# EAGLE schematic Nava_v1.02 (EAGLE 6.1), part 2 of 2
## Sheet 6 of 15: HT
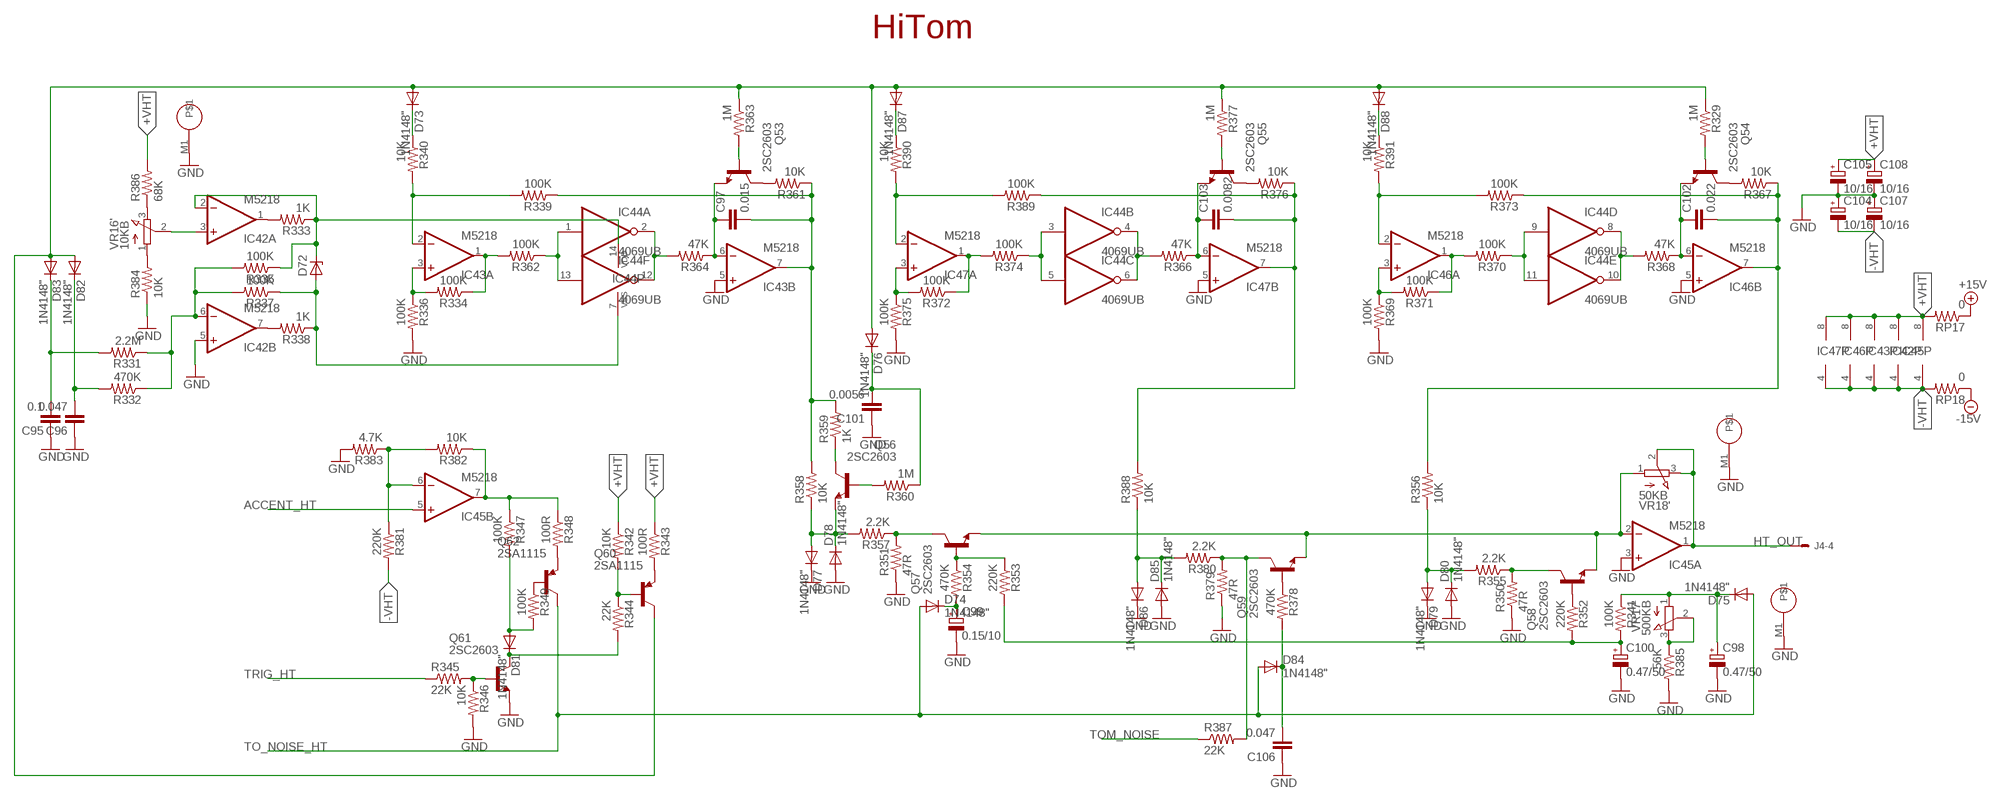
[diagram p5: schematic, sheet 6]

### Parts
C95  0.1  C-EU050-025X075  [C050-025X075]
C96  0.047  C-EU050-025X075  [C050-025X075]
C97  0.015  C-EU050-025X075  [C050-025X075]
C98  0.47/50  CPOL-EUE2-5  [E2-5]
C99  0.15/10  CPOL-EUE2-5  [E2-5]
C100  0.47/50  CPOL-EUE2-5  [E2-5]
C101  0.0056  C-EU050-025X075  [C050-025X075]
C102  0.022  C-EU050-025X075  [C050-025X075]
C103  0.0082  C-EU050-025X075  [C050-025X075]
C104  10/16  CPOL-EUE2-5  [E2-5]
C105  10/16  CPOL-EUE2-5  [E2-5]
C106  0.047  C-EU050-025X075  [C050-025X075]
C107  10/16  CPOL-EUE2-5  [E2-5]
C108  10/16  CPOL-EUE2-5  [E2-5]
D72  ZENER-DIODE  [DO41-7]
D73  1N4148"  [DO35-7C]
D74  1N4148"  [DO35-7C]
D75  1N4148"  [DO35-7C]
D76  1N4148"  [DO35-7C]
D77  1N4148"  [DO35-7C]
D78  1N4148"  [DO35-7C]
D79  1N4148"  [DO35-7C]
D80  1N4148"  [DO35-7C]
D81  1N4148"  [DO35-7C]
D82  1N4148"  [DO35-7C]
D83  1N4148"  [DO35-7C]
D84  1N4148"  [DO35-7C]
D85  1N4148"  [DO35-7C]
D86  1N4148"  [DO35-7C]
D87  1N4148"  [DO35-7C]
D88  1N4148"  [DO35-7C]
IC42  M5218  [SIL8]
IC43  M5218  [SIL8]
IC44  4069UB  4069N  [DIL14]
IC45  M5218  [SIL8]
IC46  M5218  [SIL8]
IC47  M5218  [SIL8]
Q53  2SC2603  [TO92-ECB]
Q54  2SC2603  [TO92-ECB]
Q55  2SC2603  [TO92-ECB]
Q56  2SC2603  [TO92-ECB]
Q57  2SC2603  [TO92-ECB]
Q58  2SC2603  [TO92-ECB]
Q59  2SC2603  [TO92-ECB]
Q60  2SA1115  [TO92-ECB-PNP]
Q61  2SC2603  [TO92-ECB]
Q62  2SA1115  [TO92-ECB-PNP]
R329  1M  R-US_0207/7  [0207/7]
R331  2.2M  R-US_0207/7  [0207/7]
R332  470K  R-US_0207/7  [0207/7]
R333  1K  R-US_0207/7  [0207/7]
R334  100K  R-US_0207/7  [0207/7]
R335  100K  R-US_0207/7  [0207/7]
R336  100K  R-US_0207/7  [0207/7]
R337  100K  R-US_0207/7  [0207/7]
R338  1K  R-US_0207/7  [0207/7]
R339  100K  R-US_0207/7  [0207/7]
R340  10K  R-US_0207/7  [0207/7]
R341  100K  R-US_0207/7  [0207/7]
R342  10K  R-US_0207/7  [0207/7]
R343  100R  R-US_0207/7  [0207/7]
R344  22K  R-US_0207/7  [0207/7]
R345  22K  R-US_0207/7  [0207/7]
R346  10K  R-US_0207/7  [0207/7]
R347  100K  R-US_0207/7  [0207/7]
R348  100R  R-US_0207/7  [0207/7]
R349  100K  R-US_0207/7  [0207/7]
R350  47R  R-US_0207/7  [0207/7]
R351  47R  R-US_0207/7  [0207/7]
R352  220K  R-US_0207/7  [0207/7]
R353  220K  R-US_0207/7  [0207/7]
R354  470K  R-US_0207/7  [0207/7]
R355  2.2K  R-US_0207/7  [0207/7]
R356  10K  R-US_0207/7  [0207/7]
R357  2.2K  R-US_0207/7  [0207/7]
R358  10K  R-US_0207/7  [0207/7]
R359  1K  R-US_0207/7  [0207/7]
R360  1M  R-US_0207/7  [0207/7]
R361  10K  R-US_0207/7  [0207/7]
R362  100K  R-US_0207/7  [0207/7]
R363  1M  R-US_0207/7  [0207/7]
R364  47K  R-US_0207/7  [0207/7]
R366  47K  R-US_0207/7  [0207/7]
R367  10K  R-US_0207/7  [0207/7]
R368  47K  R-US_0207/7  [0207/7]
R369  100K  R-US_0207/7  [0207/7]
R370  100K  R-US_0207/7  [0207/7]
R371  100K  R-US_0207/7  [0207/7]
R372  100K  R-US_0207/7  [0207/7]
R373  100K  R-US_0207/7  [0207/7]
R374  100K  R-US_0207/7  [0207/7]
R375  100K  R-US_0207/7  [0207/7]
R376  10K  R-US_0207/7  [0207/7]
R377  1M  R-US_0207/7  [0207/7]
R378  470K  R-US_0207/7  [0207/7]
R379  47R  R-US_0207/7  [0207/7]
R380  2.2K  R-US_0207/7  [0207/7]
R381  220K  R-US_0207/7  [0207/7]
R382  10K  R-US_0207/7  [0207/7]
R383  4.7K  R-US_0207/7  [0207/7]
R384  10K  R-US_0207/7  [0207/7]
R385  56K  R-US_0207/7  [0207/7]
R386  68K  R-US_0207/7  [0207/7]
R387  22K  R-US_0207/7  [0207/7]
R388  10K  R-US_0207/7  [0207/7]
R389  100K  R-US_0207/7  [0207/7]
R390  10K  R-US_0207/7  [0207/7]
R391  10K  R-US_0207/7  [0207/7]
RP17  0  R-US_0207/7  [0207/7]
RP18  0  R-US_0207/7  [0207/7]
VR16  10KB  EVUF3A  [EVUF]
VR17  500KB  EVUF3A  [EVUF]
VR18  50KB  EVUF3A  [EVUF]

### Nets
+15V: RP17.1 ; also sheet 1,2,3,4,7,8,9,11,12,13
+VHT: C105.+ C108.+ IC42.8(P:V+) IC43.8(P:V+) IC45.8(P:V+) IC46.8(P:V+) IC47.8(P:V+) R342.1 R343.1 R386.2 RP17.2
-15V: RP18.1 ; also sheet 1,2,3,4,7,8,9,11,12,13
-VHT [power]: C104.- C107.- IC42.4(P:V-) IC43.4(P:V-) IC45.4(P:V-) IC46.4(P:V-) IC47.4(P:V-) R381.2 RP18.2
ACCENT_HT: IC45.5(B:+IN) ; also sheet 1
GND: C95.1 C96.1 C98.- C99.- C100.- C101.1 C104.+ C105.- C106.1 C107.+ C108.- D77.C D78.A D79.C D80.A D85.A D86.C IC42.5(B:+IN) IC43.5(B:+IN) IC45.3(A:+IN) IC46.5(B:+IN) IC47.5(B:+IN) Q61.E R336.2 R346.2 R350.1 R351.1 R369.2 R375.2 R379.1 R383.2 R384.1 R385.2 VR16.M1 VR17.M1 VR18.M1 ; also sheet 1,2,3,4,5,7,8,9,10,11,12,13,14,15
HT_OUT: IC45.1(A:OUT) J4.4 VR18.2(':S) VR18.3(':E)
N$618: C97.1 IC43.6(B:-IN) Q53.E R364.1
N$619: Q53.C R361.2
N$620: IC42.1(A:OUT) R333.2
N$621: IC42.7(B:OUT) R338.2
N$622: IC42.6(B:-IN) R331.1 R332.1 R335.2 R337.2
N$623: D72.A IC44.7(P:VSS) R337.1 R338.1
N$624: D72.C IC42.2(A:-IN) IC44.14(P:VDD) R333.1 R335.1
N$625: R386.1 VR16.3(':E)
N$626: R384.2 VR16.1(':A)
N$627: IC42.3(A:+IN) VR16.2(':S)
N$628: IC43.3(A:+IN) R334.2 R336.1
N$629: IC43.2(A:-IN) R339.2 R340.2
N$630: IC43.1(A:OUT) R334.1 R362.2
N$631: IC44.1(A:I) IC44.13(F:I) R362.1
N$632: IC44.2(A:O) IC44.12(F:O) R364.2
N$644: Q53.B R363.2
N$683: C97.2 IC43.7(B:OUT) R339.1 R358.2 R359.2 R361.1
N$684: D73.C R340.1
N$685: C103.1 IC47.6(B:-IN) Q55.E R366.1
N$686: Q55.C R376.2
N$687: IC47.3(A:+IN) R372.2 R375.1
N$688: IC47.2(A:-IN) R389.2 R390.2
N$689: IC47.1(A:OUT) R372.1 R374.2
N$690: IC44.3(B:I) IC44.5(C:I) R374.1
N$691: IC44.4(B:O) IC44.6(C:O) R366.2
N$692: Q55.B R377.2
N$693: C103.2 IC47.7(B:OUT) R376.1 R388.2 R389.1
N$694: D87.C R390.1
N$695: C102.1 IC46.6(B:-IN) Q54.E R368.1
N$696: Q54.C R367.2
N$697: IC46.3(A:+IN) R369.1 R371.2
N$698: IC46.2(A:-IN) R373.2 R391.2
N$699: IC46.1(A:OUT) R370.2 R371.1
N$700: IC44.9(D:I) IC44.11(E:I) R370.1
N$701: IC44.8(D:O) IC44.10(E:O) R368.2
N$702: Q54.B R329.2
N$703: C102.2 IC46.7(B:OUT) R356.2 R367.1 R373.1
N$704: D88.C R391.1
N$705: C96.2 D82.C R332.2
N$706: C95.2 D83.C R331.2
N$718: D73.A D76.A D82.A D83.A D87.A D88.A Q60.C R329.1 R363.1 R377.1
N$740: Q57.B R353.1 R354.1
N$744: Q57.C R351.2 R357.1
N$745: D77.A D78.C Q56.E R357.2 R358.1
N$746: Q59.B R378.1
N$747: Q59.C R379.2 R380.1 R387.2
N$748: D85.C D86.A R380.2 R388.1
N$749: Q58.B R352.1
N$750: Q58.C R350.2 R355.1
N$751: D79.A D80.C R355.2 R356.1
N$752: Q56.C R359.1
N$753: C101.2 D76.C R360.1
N$754: Q56.B R360.2
N$755: IC45.2(A:-IN) Q57.E Q58.E Q59.E VR18.1(':A)
N$756: C98.+ D75.C R341.1 VR17.1(':A)
N$757: R385.1 VR17.2(':S) VR17.3(':E)
N$758: C100.+ R341.2 R352.2 R353.2
N$759: C106.2 D84.C R378.2
N$760: C99.+ D74.C R354.2
N$761: Q62.E R348.2
N$762: Q62.B R349.1
N$763: D81.C Q61.C R344.2
N$764: IC45.6(B:-IN) R381.1 R382.2 R383.1
N$765: IC45.7(B:OUT) R347.1 R348.1 R382.1
N$766: D81.A R347.2 R349.2
N$767: Q61.B R345.2 R346.1
N$768: Q60.E R343.2
N$769: Q60.B R342.2 R344.1
TO_NOISE_HT: D74.A D75.A D84.A Q62.C ; also sheet 12
TOM_NOISE: R387.1 ; also sheet 4,5,12
TRIG_HT: R345.1 ; also sheet 1,12
Unconnected: VR16.M2 VR17.M2 VR18.M2

### Notes on the sheet
- HiTom

## Sheet 7 of 15: RM
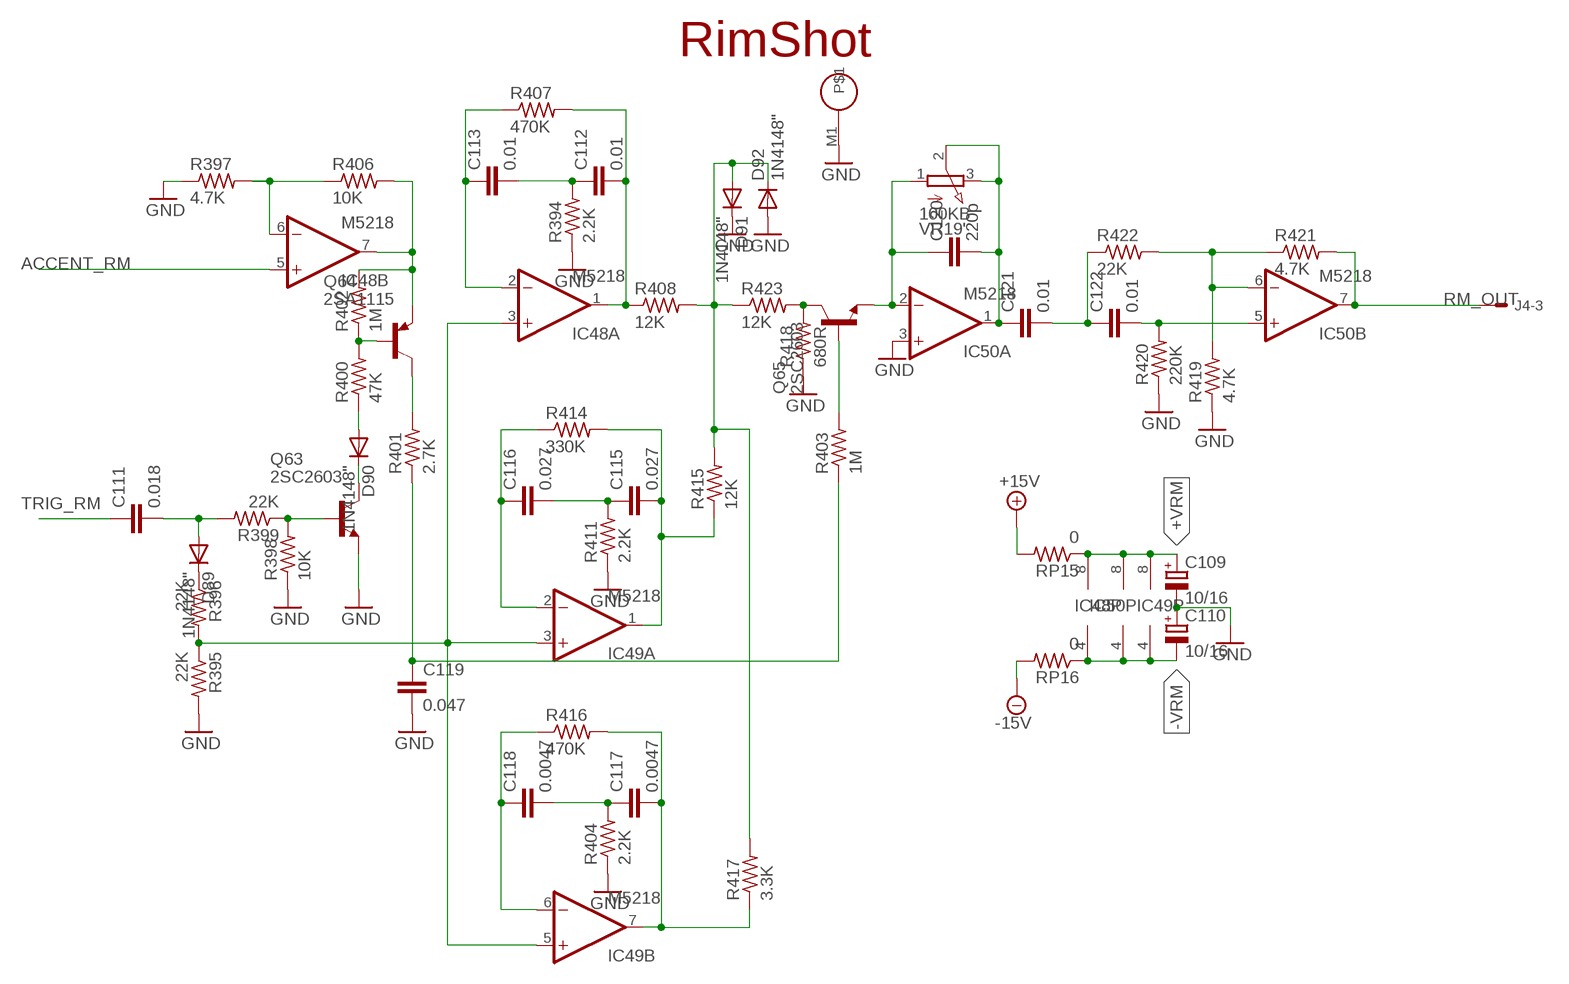
[diagram p6: schematic, sheet 7]

### Parts
C109  10/16  CPOL-EUE2-5  [E2-5]
C110  10/16  CPOL-EUE2-5  [E2-5]
C111  0.018  C-EU050-025X075  [C050-025X075]
C112  0.01  C-EU050-025X075  [C050-025X075]
C113  0.01  C-EU050-025X075  [C050-025X075]
C115  0.027  C-EU050-025X075  [C050-025X075]
C116  0.027  C-EU050-025X075  [C050-025X075]
C117  0.0047  C-EU050-025X075  [C050-025X075]
C118  0.0047  C-EU050-025X075  [C050-025X075]
C119  0.047  C-EU050-025X075  [C050-025X075]
C120  220p  C-EU050-025X075  [C050-025X075]
C121  0.01  C-EU050-025X075  [C050-025X075]
C122  0.01  C-EU050-025X075  [C050-025X075]
D89  1N4148"  [DO35-7C]
D90  1N4148"  [DO35-7C]
D91  1N4148"  [DO35-7C]
D92  1N4148"  [DO35-7C]
IC48  M5218  [SIL8]
IC49  M5218  [SIL8]
IC50  M5218  [SIL8]
Q63  2SC2603  [TO92-ECB]
Q64  2SA1115  [TO92-ECB-PNP]
Q65  2SC2603  [TO92-ECB]
R394  2.2K  R-US_0207/7  [0207/7]
R395  22K  R-US_0207/7  [0207/7]
R396  22K  R-US_0207/7  [0207/7]
R397  4.7K  R-US_0207/7  [0207/7]
R398  10K  R-US_0207/7  [0207/7]
R399  22K  R-US_0207/7  [0207/7]
R400  47K  R-US_0207/7  [0207/7]
R401  2.7K  R-US_0207/7  [0207/7]
R402  1M  R-US_0207/7  [0207/7]
R403  1M  R-US_0207/7  [0207/7]
R404  2.2K  R-US_0207/7  [0207/7]
R406  10K  R-US_0207/7  [0207/7]
R407  470K  R-US_0207/7  [0207/7]
R408  12K  R-US_0207/7  [0207/7]
R411  2.2K  R-US_0207/7  [0207/7]
R414  330K  R-US_0207/7  [0207/7]
R415  12K  R-US_0207/7  [0207/7]
R416  470K  R-US_0207/7  [0207/7]
R417  3.3K  R-US_0207/7  [0207/7]
R418  680R  R-US_0207/7  [0207/7]
R419  4.7K  R-US_0207/7  [0207/7]
R420  220K  R-US_0207/7  [0207/7]
R421  4.7K  R-US_0207/7  [0207/7]
R422  22K  R-US_0207/7  [0207/7]
R423  12K  R-US_0207/7  [0207/7]
RP15  0  R-US_0207/7  [0207/7]
RP16  0  R-US_0207/7  [0207/7]
VR19  100KB  EVUF3A  [EVUF]

### Nets
+15V: RP15.2 ; also sheet 1,2,3,4,6,8,9,11,12,13
+VRM: C109.+ IC48.8(P:V+) IC49.8(P:V+) IC50.8(P:V+) RP15.1
-15V: RP16.2 ; also sheet 1,2,3,4,6,8,9,11,12,13
-VRM: C110.- IC48.4(P:V-) IC49.4(P:V-) IC50.4(P:V-) RP16.1
ACCENT_RM: IC48.5(B:+IN) ; also sheet 1
C117: C117.2 IC49.7(B:OUT) R416.2 R417.1
GND: C109.- C110.+ C119.2 D91.C D92.A IC50.3(A:+IN) Q63.E R394.1 R395.2 R397.1 R398.1 R404.1 R411.1 R418.1 R419.1 R420.1 VR19.M1 ; also sheet 1,2,3,4,5,6,8,9,10,11,12,13,14,15
N$275: C115.1 C116.2 R411.2
N$281: C116.1 IC49.2(A:-IN) R414.1
N$282: C115.2 IC49.1(A:OUT) R414.2 R415.1
N$283: C112.1 C113.2 R394.2
N$284: C113.1 IC48.2(A:-IN) R407.1
N$285: C112.2 IC48.1(A:OUT) R407.2 R408.1
N$286: C117.1 C118.2 R404.2
N$287: C118.1 IC49.6(B:-IN) R416.1
N$288: Q64.B R400.2 R402.1
N$289: Q63.B R398.2 R399.1
N$290: D89.C R396.1
N$291: IC48.3(A:+IN) IC49.3(A:+IN) IC49.5(B:+IN) R395.1 R396.2
N$292: C111.2 D89.A R399.2
N$293: D90.C Q63.C
N$294: D90.A R400.1
N$295: Q64.C R401.2
N$296: C119.1 R401.1 R403.1
N$297: IC48.7(B:OUT) Q64.E R402.2 R406.2
N$298: IC48.6(B:-IN) R397.2 R406.1
N$299: Q65.C R418.2 R423.2
N$300: D91.A D92.C R408.2 R415.2 R417.2 R423.1
N$384: Q65.B R403.2
N$450: C120.1 IC50.2(A:-IN) Q65.E VR19.1(':A)
N$469: C120.2 C121.1 IC50.1(A:OUT) VR19.2(':S) VR19.3(':E)
N$485: C121.2 C122.1 R422.1
N$616: IC50.6(B:-IN) R419.2 R421.1 R422.2
N$617: C122.2 IC50.5(B:+IN) R420.2
RM_OUT: IC50.7(B:OUT) J4.3 R421.2
TRIG_RM: C111.1 ; also sheet 1
Unconnected: VR19.M2

### Notes on the sheet
- RimShot

## Sheet 8 of 15: HC
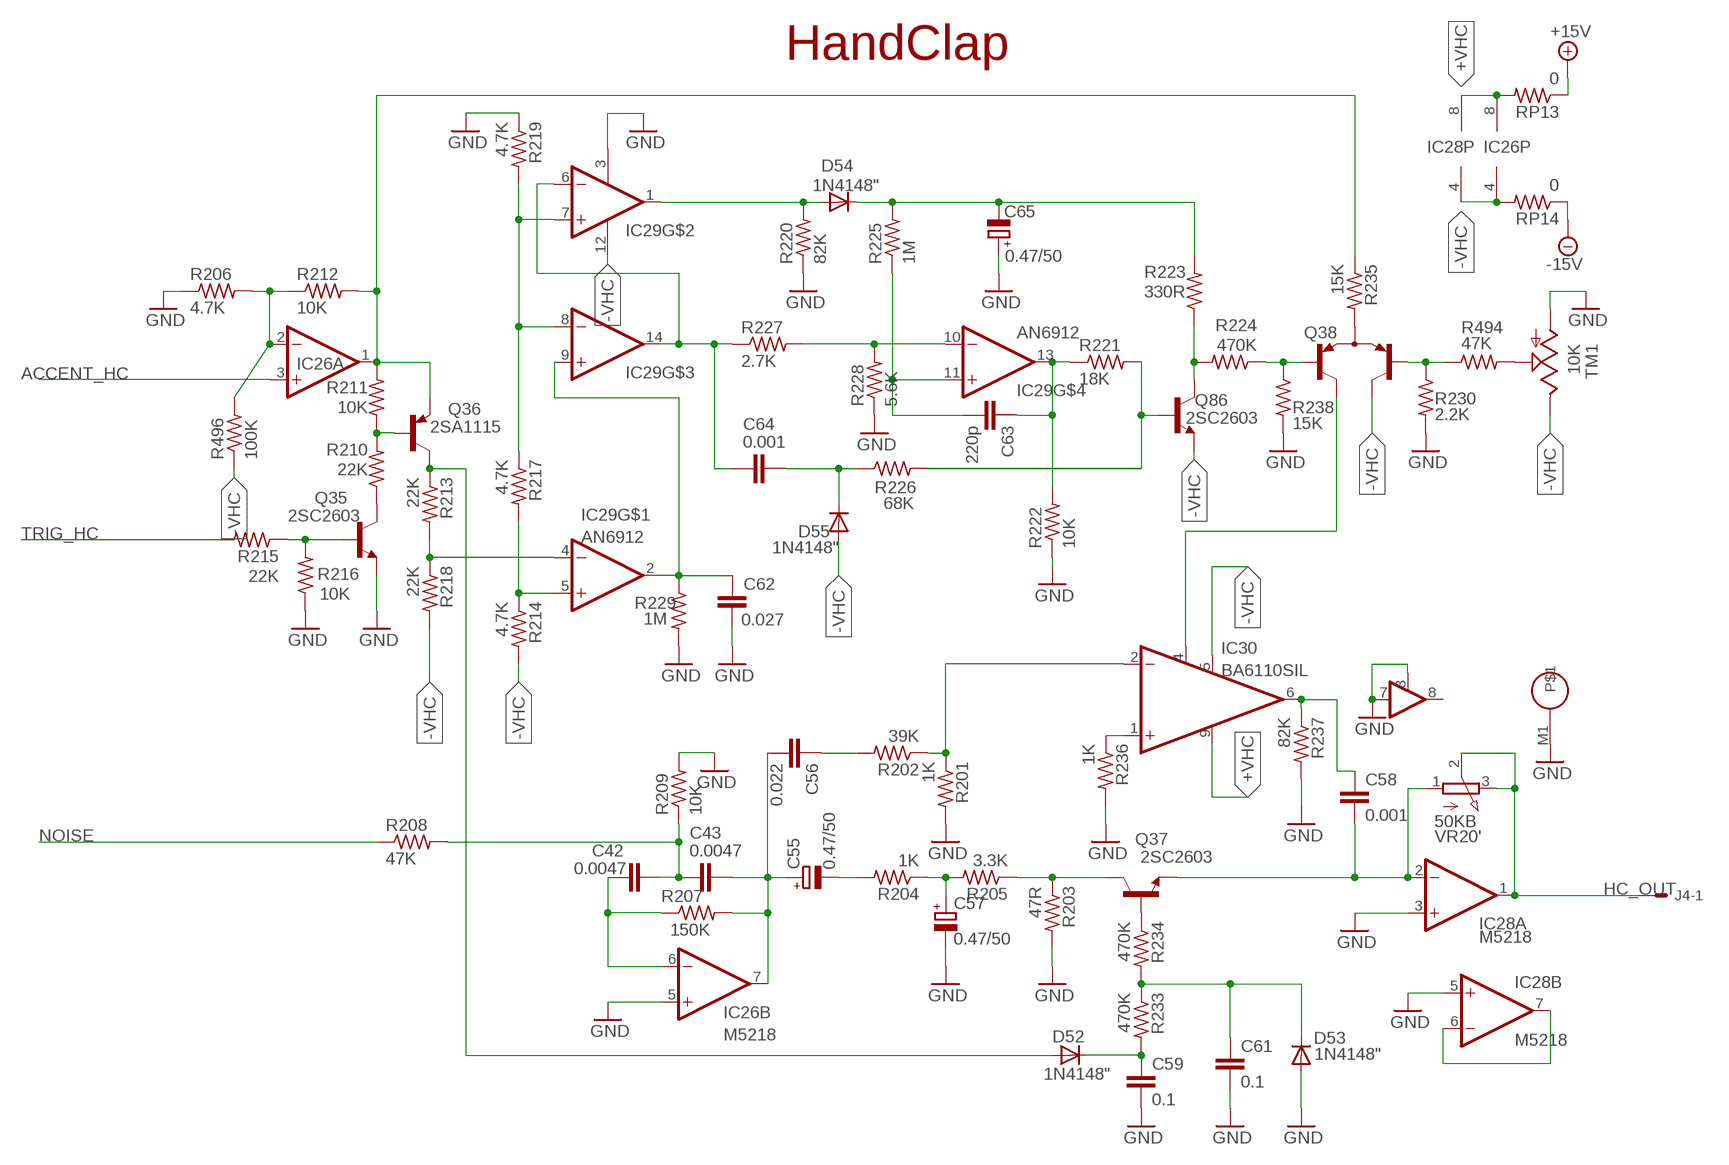
[diagram p7: schematic, sheet 8]

### Parts
C42  0.0047  C-EU050-025X075  [C050-025X075]
C43  0.0047  C-EU050-025X075  [C050-025X075]
C55  0.47/50  CPOL-EUE2-5  [E2-5]
C56  0.022  C-EU050-025X075  [C050-025X075]
C57  0.47/50  CPOL-EUE2-5  [E2-5]
C58  0.001  C-EU050-025X075  [C050-025X075]
C59  0.1  C-EU050-025X075  [C050-025X075]
C61  0.1  C-EU050-025X075  [C050-025X075]
C62  0.027  C-EU050-025X075  [C050-025X075]
C63  220p  C-EU050-025X075  [C050-025X075]
C64  0.001  C-EU050-025X075  [C050-025X075]
C65  0.47/50  CPOL-EUE2-5  [E2-5]
D52  1N4148"  [DO35-7C]
D53  1N4148"  [DO35-7C]
D54  1N4148"  [DO35-7C]
D55  1N4148"  [DO35-7C]
IC26  M5218  [SIL8]
IC28  M5218  [SIL8]
IC29  AN6912  [DIL14]
IC30  BA6110SIL  [SIL09]
Q35  2SC2603  [TO92-ECB]
Q36  2SA1115  [TO92-ECB-PNP]
Q37  2SC2603  [TO92-ECB]
Q38  2SA798  [SIP-5]
Q86  2SC2603  [TO92-ECB]
R201  1K  R-US_0207/7  [0207/7]
R202  39K  R-US_0207/7  [0207/7]
R203  47R  R-US_0207/7  [0207/7]
R204  1K  R-US_0207/7  [0207/7]
R205  3.3K  R-US_0207/7  [0207/7]
R206  4.7K  R-US_0207/7  [0207/7]
R207  150K  R-US_0207/7  [0207/7]
R208  47K  R-US_0207/7  [0207/7]
R209  10K  R-US_0207/7  [0207/7]
R210  22K  R-US_0207/7  [0207/7]
R211  10K  R-US_0207/7  [0207/7]
R212  10K  R-US_0207/7  [0207/7]
R213  22K  R-US_0207/7  [0207/7]
R214  4.7K  R-US_0207/7  [0207/7]
R215  22K  R-US_0207/7  [0207/7]
R216  10K  R-US_0207/7  [0207/7]
R217  4.7K  R-US_0207/7  [0207/7]
R218  22K  R-US_0207/7  [0207/7]
R219  4.7K  R-US_0207/7  [0207/7]
R220  82K  R-US_0207/7  [0207/7]
R221  18K  R-US_0207/7  [0207/7]
R222  10K  R-US_0207/7  [0207/7]
R223  330R  R-US_0207/7  [0207/7]
R224  470K  R-US_0207/7  [0207/7]
R225  1M  R-US_0207/7  [0207/7]
R226  68K  R-US_0207/7  [0207/7]
R227  2.7K  R-US_0207/7  [0207/7]
R228  5.6K  R-US_0207/7  [0207/7]
R229  1M  R-US_0207/7  [0207/7]
R230  2.2K  R-US_0207/7  [0207/7]
R233  470K  R-US_0207/7  [0207/7]
R234  470K  R-US_0207/7  [0207/7]
R235  15K  R-US_0207/7  [0207/7]
R236  1K  R-US_0207/7  [0207/7]
R237  82K  R-US_0207/7  [0207/7]
R238  15K  R-US_0207/7  [0207/7]
R494  47K  R-US_0207/7  [0207/7]
R496  100K  R-US_0207/7  [0207/7]
RP13  0  R-US_0207/7  [0207/7]
RP14  0  R-US_0207/7  [0207/7]
TM1  10K  TRIM_US-S64W  [S64W]
VR20  50KB  EVUF3A  [EVUF]

### Nets
+15V: RP13.1 ; also sheet 1,2,3,4,6,7,9,11,12,13
+VHC: IC26.8(P:V+) IC28.8(P:V+) IC30.9(V+) RP13.2
-15V: RP14.1 ; also sheet 1,2,3,4,6,7,9,11,12,13
-VHC: D55.A IC26.4(P:V-) IC28.4(P:V-) IC29.12(V-) IC30.5(V-) Q38.4(C2) Q86.E R214.2 R218.2 R496.1 RP14.2 TM1.E
ACCENT_HC: IC26.3(A:+IN) ; also sheet 1
GND: C57.- C59.2 C61.2 C62.1 C65.+ D53.A IC26.5(B:+IN) IC28.3(A:+IN) IC28.5(B:+IN) IC29.3(V+) IC30.3 IC30.7(IN1) Q35.E R201.2 R203.2 R206.1 R209.2 R216.1 R219.1 R220.1 R222.1 R228.1 R229.2 R230.2 R236.2 R237.2 R238.2 TM1.A VR20.M1 ; also sheet 1,2,3,4,5,6,7,9,10,11,12,13,14,15
HC_OUT: IC28.1(A:OUT) J4.1 VR20.2(':S) VR20.3(':E)
N$277: IC26.1(A:OUT) Q36.E R211.2 R212.2 R235.1
N$278: IC26.2(A:-IN) R206.2 R212.1 R496.2
N$279: Q86.B R221.2 R226.2
N$280: C63.1 IC29.13(OUT) R221.1 R222.2
N$369: Q36.B R210.2 R211.1
N$370: Q35.C R210.1
N$371: D52.A Q36.C R213.1
N$372: Q35.B R215.1 R216.2
N$373: C58.1 IC30.6(OUT) R237.1
N$374: IC29.4(-IN) R213.2 R218.1
N$375: IC29.5(+IN) R214.1 R217.2
N$376: IC29.7(+IN) IC29.8(-IN) R217.1 R219.2
N$379: C64.2 IC29.6(-IN) IC29.14(OUT) R227.1
N$380: C62.2 IC29.2(OUT) IC29.9(+IN) R229.1
N$381: D54.A IC29.1(OUT) R220.2
N$382: C65.- D54.C R223.2 R225.2
N$383: C63.2 IC29.11(+IN) R225.1
N$385: IC29.10(-IN) R227.2 R228.2
N$386: C64.1 D55.C R226.1
N$387: Q86.C R223.1 R224.2
N$388: Q38.1(B1) R224.1 R238.1
N$389: R494.2 TM1.S
N$390: Q37.B R234.1
N$391: C61.1 D53.C R233.1 R234.2
N$392: IC30.2(-IN) R201.1 R202.1
N$393: C56.1 R202.2
N$394: C42.1 C43.2 R208.2 R209.1
N$395: C42.2 IC26.6(B:-IN) R207.1
N$396: C43.1 C55.+ C56.2 IC26.7(B:OUT) R207.2
N$397: IC30.1(+IN) R236.1
N$398: C55.- R204.2
N$399: C57.+ R204.1 R205.2
N$400: Q37.C R203.1 R205.1
N$401: C59.1 D52.C R233.2
N$402: C58.2 IC28.2(A:-IN) Q37.E VR20.1(':A)
N$403: Q38.5(B2) R230.1 R494.1
N$404: Q38.3(E) R235.2
N$405: IC30.4(C) Q38.2(C1)
N$551: IC28.6(B:-IN) IC28.7(B:OUT)
NOISE [NOISE]: R208.1 ; also sheet 2,3,12
TRIG_HC: R215.2 ; also sheet 1
Unconnected: IC30.8(OUT1) VR20.M2

### Notes on the sheet
- HandClap

## Sheet 9 of 15: HH
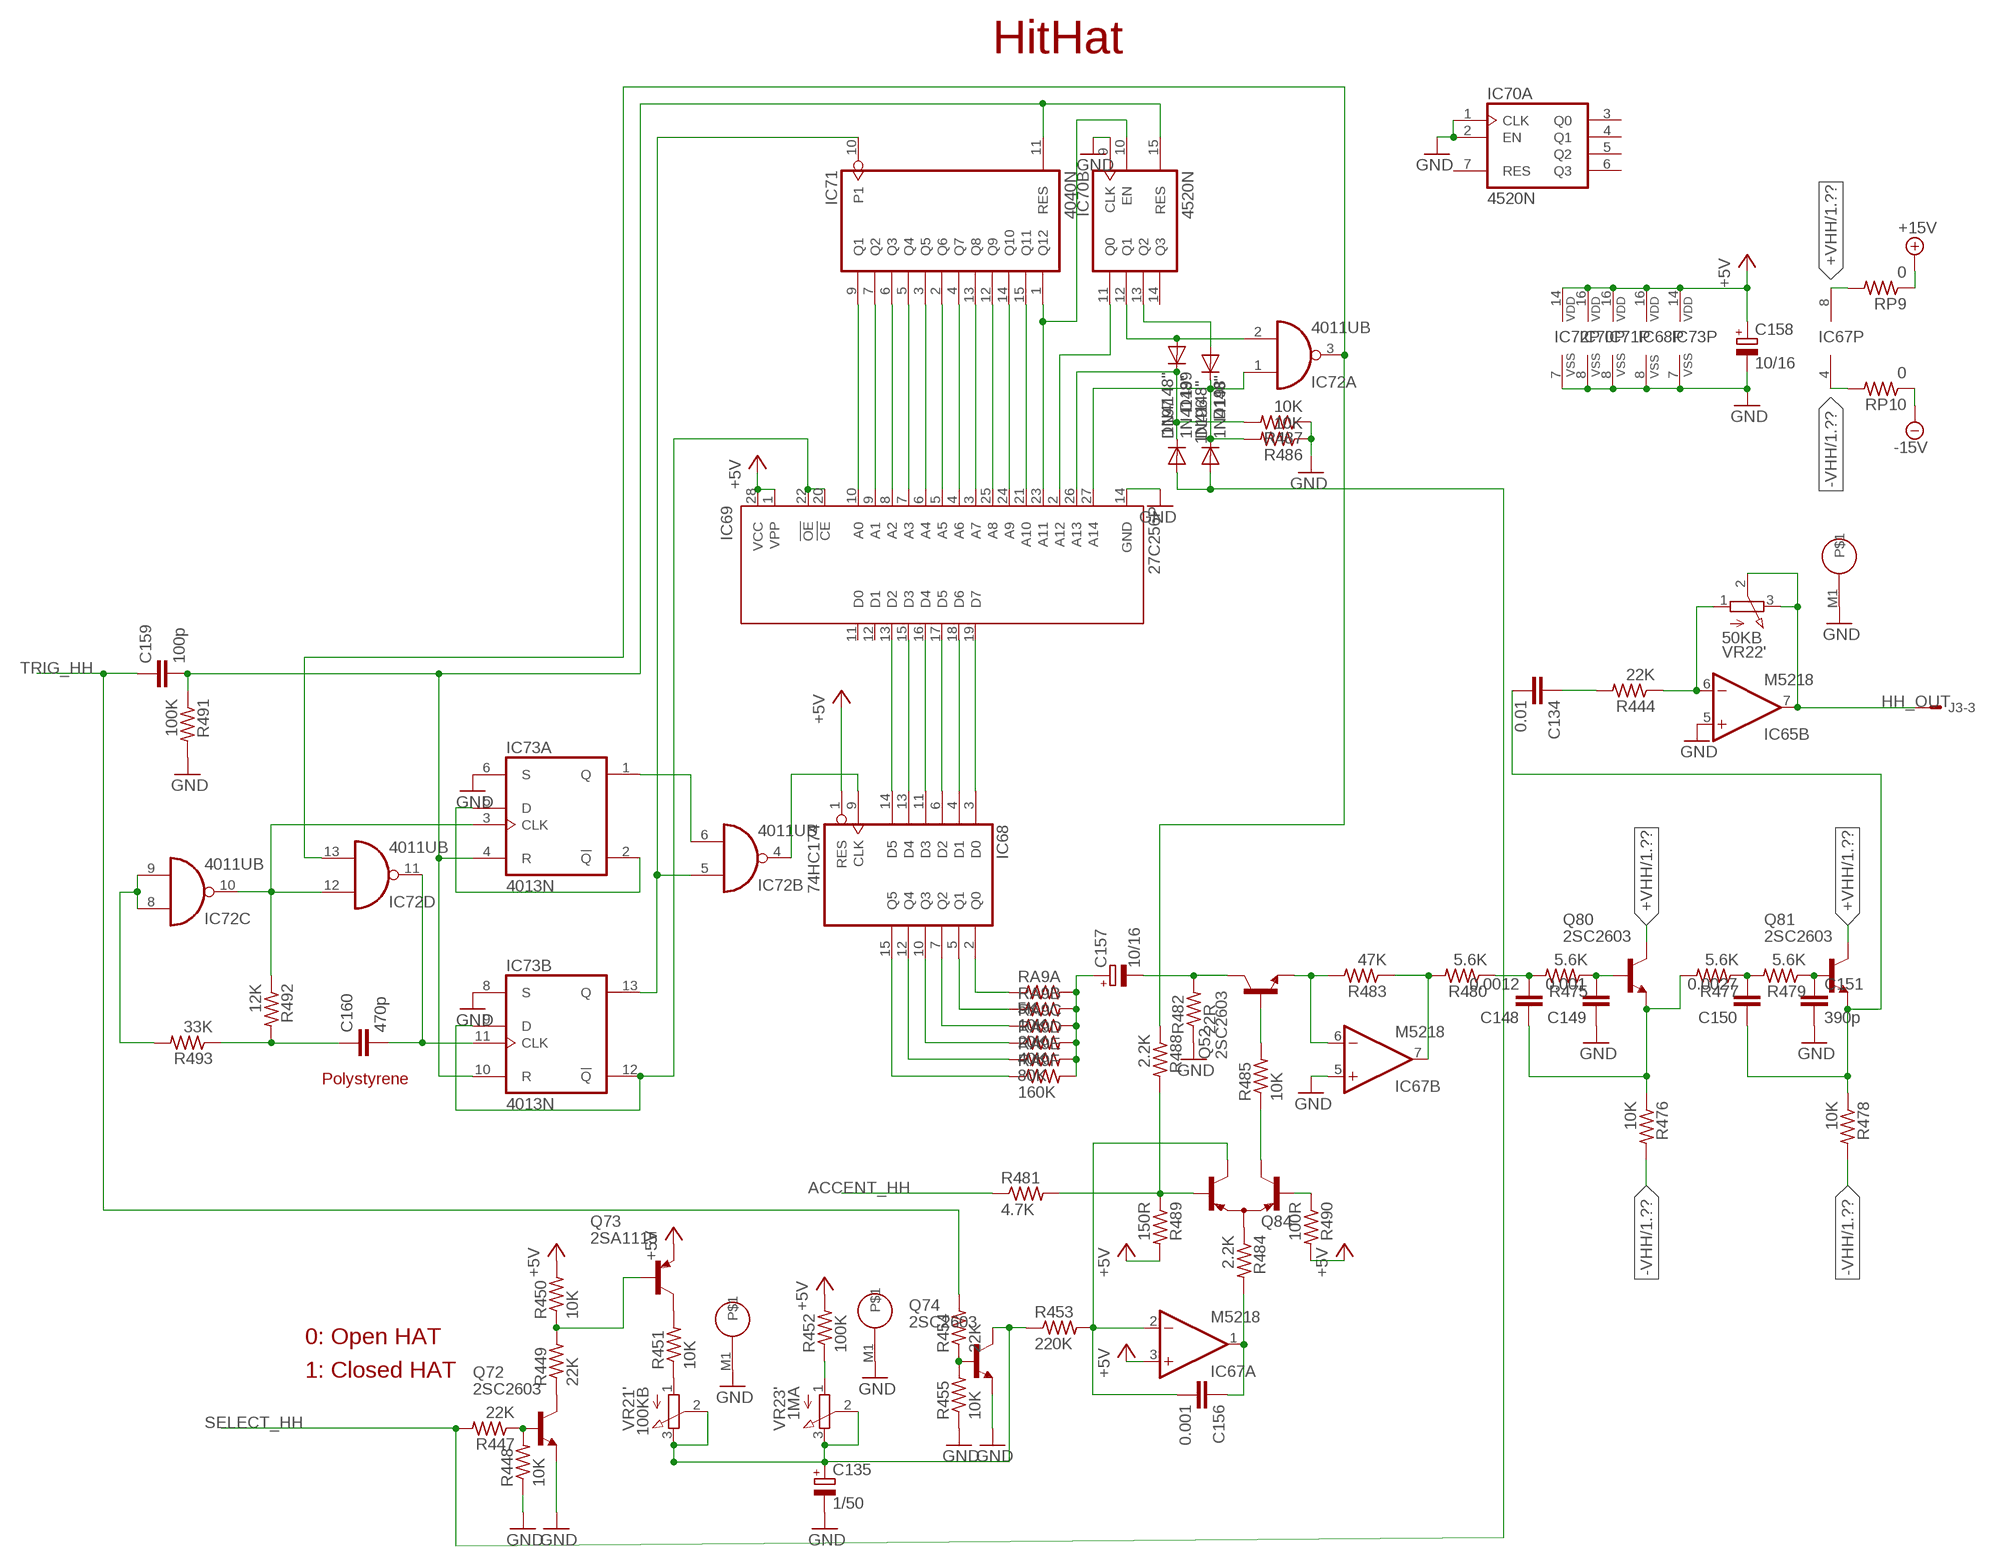
[diagram p8: schematic, sheet 9]

### Parts
C134  0.01  C-EU050-025X075  [C050-025X075]
C135  1/50  CPOL-EUE2-5  [E2-5]
C148  0.0012  C-EU050-025X075  [C050-025X075]
C149  0.001  C-EU050-025X075  [C050-025X075]
C150  0.0027  C-EU050-025X075  [C050-025X075]
C151  390p  C-EU025-050  [C025_RE]
C156  0.001  C-EU050-025X075  [C050-025X075]
C157  10/16  CPOL-EUE2-5  [E2-5]
C158  10/16  CPOL-EUE2-5  [E2-5]
C159  100p  C-EU050-025X075  [C050-025X075]
C160  470p  C-EU025-050  [C025_RE]
D196  1N4148"  [DO35-7C]
D197  1N4148"  [DO35-7C]
D198  1N4148"  [DO35-7C]
D199  1N4148"  [DO35-7C]
IC65  M5218  [SIL8]
IC67  M5218  [SIL8]
IC68  74HC174  4174P  [DIL16]
IC69  27C256P  [DIL28-6]
IC70  4520N  [DIL16]
IC71  4040N  [DIL16]
IC72  4011UB  4011N  [DIL14]
IC73  4013N  [DIL14]
J3  22-27-2041-04  [6410-04]
Q52  2SC2603  [TO92-ECB]
Q72  2SC2603  [TO92-ECB]
Q73  2SA1115  [TO92-ECB-PNP]
Q74  2SC2603  [TO92-ECB]
Q80  2SC2603  [TO92-ECB]
Q81  2SC2603  [TO92-ECB]
Q84  2SA798  [SIP-5]
R444  22K  R-US_0207/7  [0207/7]
R447  22K  R-US_0207/7  [0207/7]
R448  10K  R-US_0207/7  [0207/7]
R449  22K  R-US_0207/7  [0207/7]
R450  10K  R-US_0207/7  [0207/7]
R451  10K  R-US_0207/7  [0207/7]
R452  100K  R-US_0207/7  [0207/7]
R453  220K  R-US_0207/7  [0207/7]
R454  22K  R-US_0207/7  [0207/7]
R455  10K  R-US_0207/7  [0207/7]
R475  5.6K  R-US_0207/7  [0207/7]
R476  10K  R-US_0207/7  [0207/7]
R477  5.6K  R-US_0207/7  [0207/7]
R478  10K  R-US_0207/7  [0207/7]
R479  5.6K  R-US_0207/7  [0207/7]
R480  5.6K  R-US_0207/7  [0207/7]
R481  4.7K  R-US_0207/7  [0207/7]
R482  22R  R-US_0207/7  [0207/7]
R483  47K  R-US_0207/7  [0207/7]
R484  2.2K  R-US_0207/7  [0207/7]
R485  10K  R-US_0207/7  [0207/7]
R486  10K  R-US_0207/7  [0207/7]
R487  10K  R-US_0207/7  [0207/7]
R488  2.2K  R-US_0207/7  [0207/7]
R489  150R  R-US_0207/7  [0207/7]
R490  100R  R-US_0207/7  [0207/7]
R491  100K  R-US_0207/7  [0207/7]
R492  12K  R-US_0207/7  [0207/7]
R493  33K  R-US_0207/7  [0207/7]
RA9A  5K  R-US_0207/7  [0207/7]
RA9B  10K  R-US_0207/7  [0207/7]
RA9C  20K  R-US_0207/7  [0207/7]
RA9D  40K  R-US_0207/7  [0207/7]
RA9E  80K  R-US_0207/7  [0207/7]
RA9F  160K  R-US_0207/7  [0207/7]
RP9  0  R-US_0207/7  [0207/7]
RP10  0  R-US_0207/7  [0207/7]
VR21  100KB  EVUF3A  [EVUF]
VR22  50KB  EVUF3A  [EVUF]
VR23  1MA  EVUF3A  [EVUF]

### Nets
+5V: C158.+ IC67.3(A:+IN) IC68.1(RES) IC68.16(VDD) IC69.1(VPP) IC69.28(VCC) IC70.16(P:VDD) IC71.16(VDD) IC72.14(P:VDD) IC73.14(P:VDD) Q73.E R450.2 R452.2 R489.2 R490.2 ; also sheet 1,10,11,14,15
+15V: RP9.1 ; also sheet 1,2,3,4,6,7,8,11,12,13
+VHH: IC67.8(P:V+) Q80.C Q81.C RP9.2 ; also sheet 1
-15V: RP10.1 ; also sheet 1,2,3,4,6,7,8,11,12,13
-VHH: IC67.4(P:V-) R476.2 R478.2 RP10.2 ; also sheet 1
ACCENT_HH: R481.1 ; also sheet 1
CRASH_OUT2: C135.+ Q74.C R453.1 VR21.2(':S) VR21.3(':E) VR23.2(':S) VR23.3(':E)
GND: C135.- C149.1 C151.- C158.- IC65.5(B:+IN) IC67.5(B:+IN) IC68.8(VSS) IC69.14(GND) IC70.1(A:CLK) IC70.2(A:EN) IC70.8(P:VSS) IC70.9(B:CLK) IC71.8(VSS) IC72.7(P:VSS) IC73.6(A:S) IC73.7(P:VSS) IC73.8(B:S) Q72.E Q74.E R448.1 R455.1 R482.1 R486.1 R487.1 R491.2 VR21.M1 VR22.M1 VR23.M1 ; also sheet 1,2,3,4,5,6,7,8,10,11,12,13,14,15
HH_OUT: IC65.7(B:OUT) J3.3 VR22.2(':S) VR22.3(':E)
HT_OUT3: IC72.10(C:O) IC72.12(D:I0) IC73.3(A:CLK) R492.1
N$523: IC72.8(C:I0) IC72.9(C:I1) R493.2
N$524: C160.+ R492.2 R493.1
N$525: IC72.3(A:O) IC72.13(D:I1) R488.1
N$526: C160.- IC72.11(D:O) IC73.11(B:CLK)
N$527: IC73.2(A:!Q) IC73.5(A:D)
N$528: IC71.10(P1) IC72.5(B:I0) IC73.13(B:Q)
N$529: IC72.6(B:I1) IC73.1(A:Q)
N$530: IC68.9(CLK) IC72.4(B:O)
N$531: D197.C D199.C IC69.26(A13) R487.2
N$532: C157.+ RA9A.2 RA9B.2 RA9C.2 RA9D.2 RA9E.2 RA9F.2
N$533: D196.C D198.C IC69.27(A14) IC72.1(A:I0) R486.2
N$535: Q52.B R485.2
N$536: Q84.2(C1) R485.1
N$537: Q84.1(B1) R490.1
N$538: C157.- Q52.C R482.2
N$539: Q84.3(E) R484.1
N$540: Q84.5(B2) R481.2 R488.2 R489.1
N$541: C150.2 R477.1 R479.2
N$542: C148.2 R475.2 R480.1
N$543: C149.2 Q80.B R475.1
N$544: C151.+ Q81.B R479.1
N$545: IC67.6(B:-IN) Q52.E R483.2
N$546: IC67.7(B:OUT) R480.2 R483.1
N$547: C148.1 Q80.E R476.1 R477.2
N$548: C134.2 C150.1 Q81.E R478.1
N$549: IC65.6(B:-IN) R444.1 VR22.1(':A)
N$550: C134.1 R444.2
N$552: IC69.23(A11) IC70.10(B:EN) IC71.1(Q12)
N$553: IC69.5(A5) IC71.2(Q6)
N$554: IC69.6(A4) IC71.3(Q5)
N$555: IC69.4(A6) IC71.4(Q7)
N$556: IC69.7(A3) IC71.5(Q4)
N$557: IC69.8(A2) IC71.6(Q3)
N$558: IC69.9(A1) IC71.7(Q2)
N$559: IC69.10(A0) IC71.9(Q1)
N$560: IC69.25(A8) IC71.12(Q9)
N$561: IC69.3(A7) IC71.13(Q8)
N$562: IC69.24(A9) IC71.14(Q10)
N$563: IC69.21(A10) IC71.15(Q11)
N$564: IC69.2(A12) IC70.11(B:Q0)
N$565: D199.A IC70.12(B:Q1) IC72.2(A:I1)
N$566: D198.A IC70.13(B:Q2)
N$567: Q74.B R454.1 R455.2
N$568: IC68.3(D0) IC69.19(D7)
N$569: IC68.4(D1) IC69.18(D6)
N$570: IC68.6(D2) IC69.17(D5)
N$571: IC68.11(D3) IC69.16(D4)
N$572: IC68.13(D4) IC69.15(D3)
N$573: IC68.14(D5) IC69.13(D2)
N$574: IC68.2(Q0) RA9A.1
N$575: IC68.5(Q1) RA9B.1
N$576: IC68.7(Q2) RA9C.1
N$577: IC68.10(Q3) RA9D.1
N$578: IC68.12(Q4) RA9E.1
N$579: IC68.15(Q5) RA9F.1
N$581: C156.1 IC67.1(A:OUT) R484.2
N$582: C159.2 IC70.15(B:RES) IC71.11(RES) IC73.4(A:R) IC73.10(B:R) R491.1
N$583: C156.2 IC67.2(A:-IN) Q84.4(C2) R453.2
N$584: IC69.20(!CE) IC69.22(!OE) IC73.9(B:D) IC73.12(B:!Q)
N$585: R452.1 VR23.1(':A)
N$586: R451.1 VR21.1(':A)
N$588: Q73.C R451.2
N$589: Q72.C R449.1
N$590: Q73.B R449.2 R450.1
N$591: Q72.B R447.1 R448.2
SELECT_HH: D196.A D197.A R447.2 ; also sheet 1
TRIG_HH: C159.1 R454.2 ; also sheet 1
Unconnected: IC69.11(D0) IC69.12(D1) IC70.3(A:Q0) IC70.4(A:Q1) IC70.5(A:Q2) IC70.6(A:Q3) IC70.7(A:RES) IC70.14(B:Q3) J3.4 VR21.M2 VR22.M2 VR23.M2

### Notes on the sheet
- HitHat
- Polystyrene
- 0: Open HAT
- 1: Closed HAT

## Sheet 10 of 15: CRASH
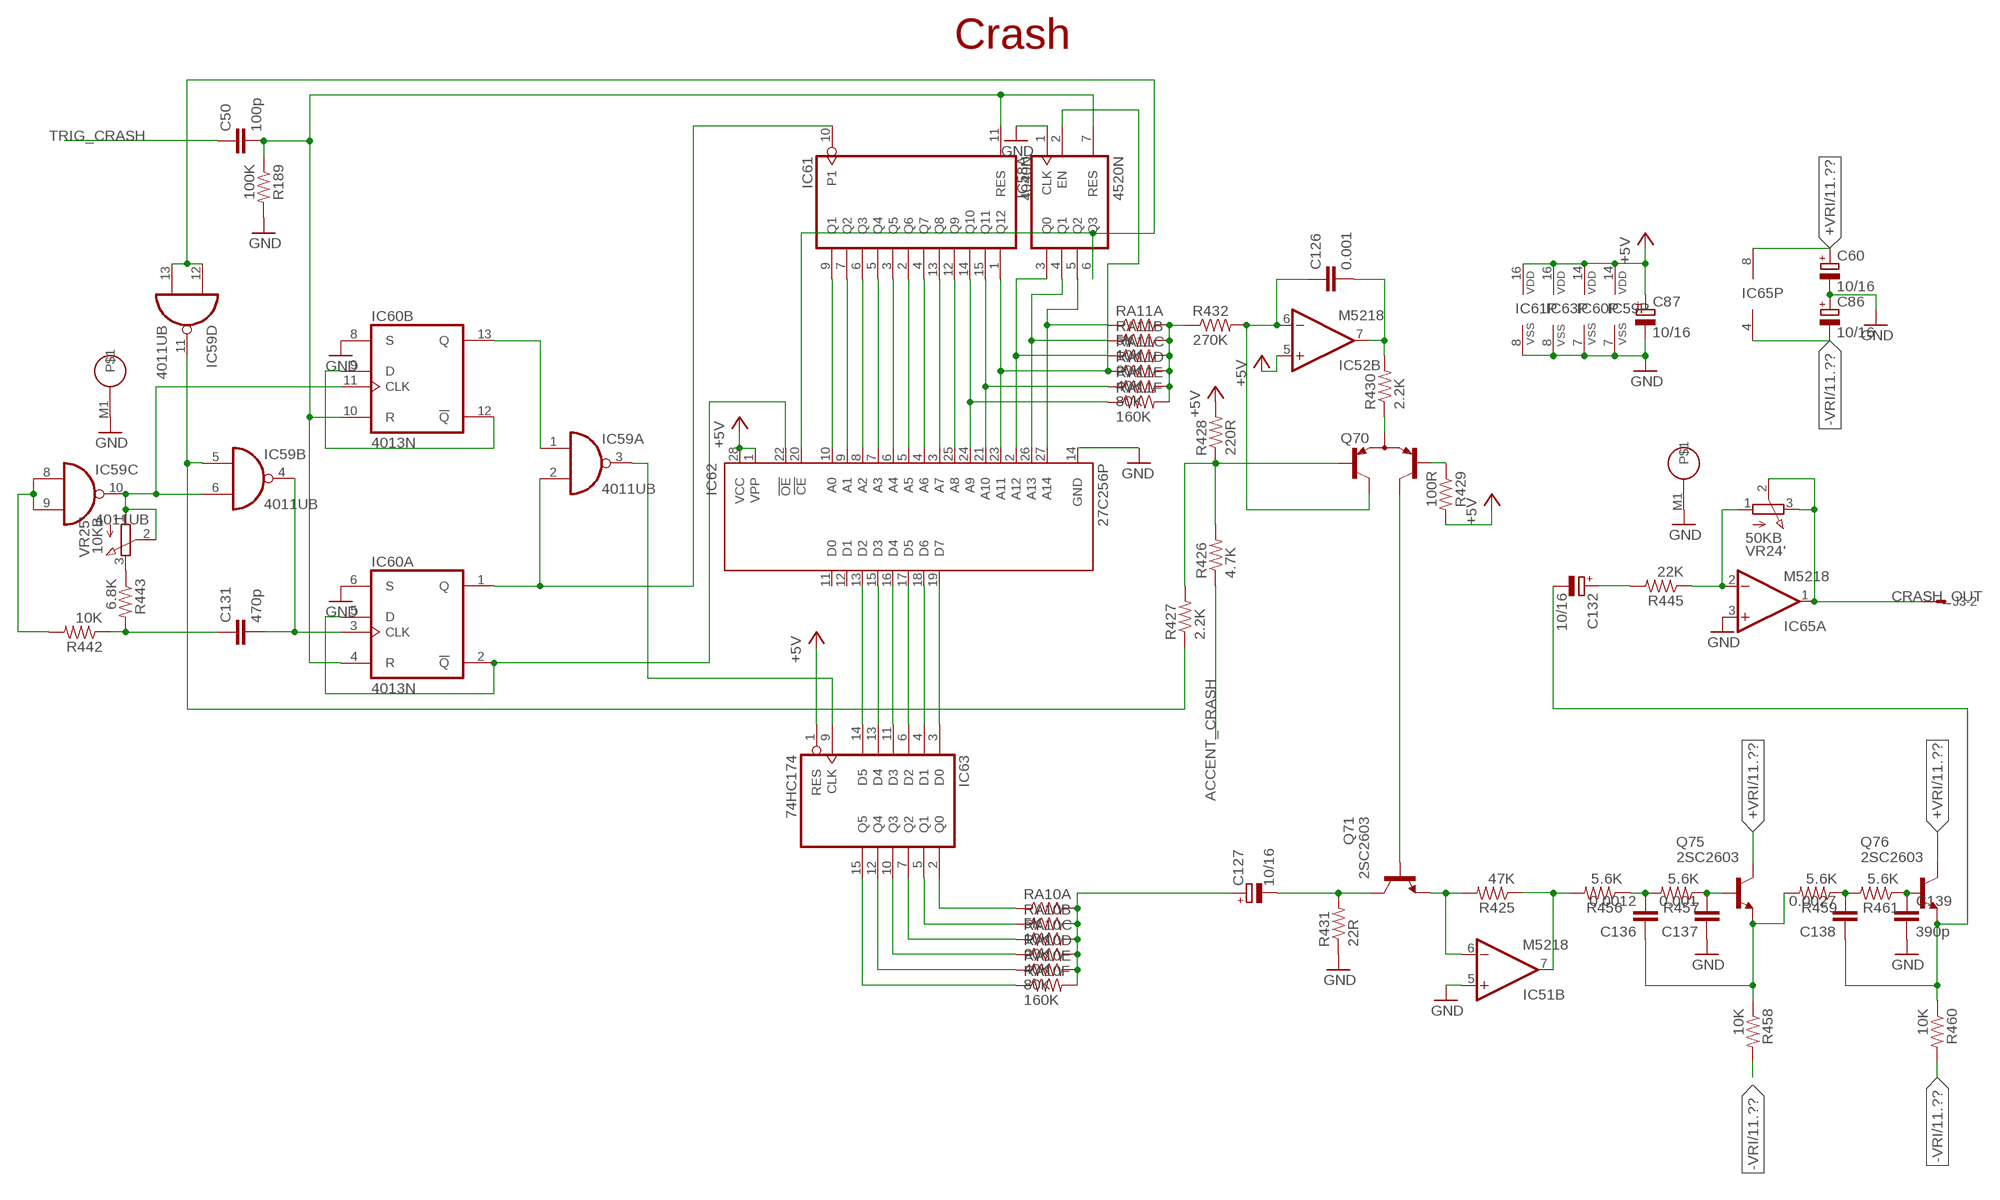
[diagram p9: schematic, sheet 10]

### Parts
C50  100p  C-EU050-025X075  [C050-025X075]
C60  10/16  CPOL-EUE2-5  [E2-5]
C86  10/16  CPOL-EUE2-5  [E2-5]
C87  10/16  CPOL-EUE2-5  [E2-5]
C126  0.001  C-EU050-025X075  [C050-025X075]
C127  10/16  CPOL-EUE2-5  [E2-5]
C131  470p  C-EU025-050  [C025_RE]
C132  10/16  CPOL-EUE2-5  [E2-5]
C136  0.0012  C-EU050-025X075  [C050-025X075]
C137  0.001  C-EU050-025X075  [C050-025X075]
C138  0.0027  C-EU050-025X075  [C050-025X075]
C139  390p  C-EU025-050  [C025_RE]
IC51  M5218  [SIL8]
IC52  M5218  [SIL8]
IC58  4520N  [DIL16]
IC59  4011UB  4011N  [DIL14]
IC60  4013N  [DIL14]
IC61  4040N  [DIL16]
IC62  27C256P  [DIL28-6]
IC63  74HC174  4174P  [DIL16]
Q70  2SA798  [SIP-5]
Q71  2SC2603  [TO92-ECB]
Q75  2SC2603  [TO92-ECB]
Q76  2SC2603  [TO92-ECB]
R189  100K  R-US_0207/7  [0207/7]
R425  47K  R-US_0207/7  [0207/7]
R426  4.7K  R-US_0207/7  [0207/7]
R427  2.2K  R-US_0207/7  [0207/7]
R428  220R  R-US_0207/7  [0207/7]
R429  100R  R-US_0207/7  [0207/7]
R430  2.2K  R-US_0207/7  [0207/7]
R431  22R  R-US_0207/7  [0207/7]
R432  270K  R-US_0207/7  [0207/7]
R442  10K  R-US_0207/7  [0207/7]
R443  6.8K  R-US_0207/7  [0207/7]
R445  22K  R-US_0207/7  [0207/7]
R456  5.6K  R-US_0207/7  [0207/7]
R457  5.6K  R-US_0207/7  [0207/7]
R458  10K  R-US_0207/7  [0207/7]
R459  5.6K  R-US_0207/7  [0207/7]
R460  10K  R-US_0207/7  [0207/7]
R461  5.6K  R-US_0207/7  [0207/7]
RA10A  5K  R-US_0207/7  [0207/7]
RA10B  10K  R-US_0207/7  [0207/7]
RA10C  20K  R-US_0207/7  [0207/7]
RA10D  40K  R-US_0207/7  [0207/7]
RA10E  80K  R-US_0207/7  [0207/7]
RA10F  160K  R-US_0207/7  [0207/7]
RA11A  5K  R-US_0207/7  [0207/7]
RA11B  10K  R-US_0207/7  [0207/7]
RA11C  20K  R-US_0207/7  [0207/7]
RA11D  40K  R-US_0207/7  [0207/7]
RA11E  80K  R-US_0207/7  [0207/7]
RA11F  160K  R-US_0207/7  [0207/7]
VR24  50KB  EVUF3A  [EVUF]
VR25  10KB  EVUF3A  [EVUF]

### Nets
+5V: C87.+ IC52.5(B:+IN) IC59.14(P:VDD) IC60.14(P:VDD) IC61.16(VDD) IC62.1(VPP) IC62.28(VCC) IC63.1(RES) IC63.16(VDD) R428.2 R429.2 ; also sheet 1,9,11,14,15
+VRI [power]: C60.+ IC65.8(P:V+) Q75.C Q76.C ; also sheet 11
-VRI [power]: C86.- IC65.4(P:V-) R458.2 R460.2 ; also sheet 11
ACCENT_CRASH: R426.1 ; also sheet 1
CRASH_OUT: IC65.1(A:OUT) J3.2 VR24.2(':S) VR24.3(':E)
GND: C60.- C86.+ C87.- C137.1 C139.- IC51.5(B:+IN) IC58.1(A:CLK) IC59.7(P:VSS) IC60.6(A:S) IC60.7(P:VSS) IC60.8(B:S) IC61.8(VSS) IC62.14(GND) IC63.8(VSS) IC65.3(A:+IN) R189.2 R431.1 VR24.M1 VR25.M1 ; also sheet 1,2,3,4,5,6,7,8,9,11,12,13,14,15
HT_OUT2: IC59.6(B:I1) IC59.10(C:O) IC60.11(B:CLK) VR25.1(':A) VR25.2(':S)
N$267: Q70.3(E) R430.1
N$424: R443.1 VR25.3(':E)
N$435: IC59.8(C:I0) IC59.9(C:I1) R442.2
N$466: C131.+ R442.1 R443.2
N$467: IC59.5(B:I0) IC59.11(D:O) R427.1
N$468: C131.- IC59.4(B:O) IC60.3(A:CLK)
N$470: IC60.9(B:D) IC60.12(B:!Q)
N$471: IC60.2(A:!Q) IC60.5(A:D) IC62.22(!OE)
N$472: IC59.1(A:I0) IC60.13(B:Q)
N$473: IC59.3(A:O) IC63.9(CLK)
N$474: IC59.2(A:I1) IC60.1(A:Q) IC61.10(P1)
N$475: IC62.19(D7) IC63.3(D0)
N$476: IC62.18(D6) IC63.4(D1)
N$477: IC62.17(D5) IC63.6(D2)
N$478: IC62.16(D4) IC63.11(D3)
N$479: IC62.15(D3) IC63.13(D4)
N$480: IC62.13(D2) IC63.14(D5)
N$481: C127.+ RA10A.2 RA10B.2 RA10C.2 RA10D.2 RA10E.2 RA10F.2
N$482: R432.1 RA11A.2 RA11B.2 RA11C.2 RA11D.2 RA11E.2 RA11F.2
N$483: C126.1 IC52.6(B:-IN) Q70.2(C1) R432.2
N$484: C126.2 IC52.7(B:OUT) R430.2
N$486: Q70.5(B2) R429.1
N$487: C127.- Q71.C R431.2
N$488: Q70.1(B1) R426.2 R427.2 R428.1
N$489: Q70.4(C2) Q71.B
N$490: C138.2 R459.1 R461.2
N$491: C136.2 R456.1 R457.2
N$492: C137.2 Q75.B R457.1
N$493: C139.+ Q76.B R461.1
N$494: IC51.6(B:-IN) Q71.E R425.2
N$495: IC51.7(B:OUT) R425.1 R456.2
N$496: C136.1 Q75.E R458.1 R459.2
N$497: C132.- C138.1 Q76.E R460.1
N$498: IC65.2(A:-IN) R445.1 VR24.1(':A)
N$499: C132.+ R445.2
N$500: IC58.2(A:EN) IC61.1(Q12) IC62.23(A11) RA11D.1
N$501: IC61.2(Q6) IC62.5(A5)
N$502: IC61.3(Q5) IC62.6(A4)
N$503: IC61.4(Q7) IC62.4(A6)
N$504: IC61.5(Q4) IC62.7(A3)
N$505: IC61.6(Q3) IC62.8(A2)
N$506: IC61.7(Q2) IC62.9(A1)
N$507: IC61.9(Q1) IC62.10(A0)
N$508: IC61.12(Q9) IC62.25(A8)
N$509: IC61.13(Q8) IC62.3(A7)
N$510: IC61.14(Q10) IC62.24(A9) RA11F.1
N$511: IC61.15(Q11) IC62.21(A10) RA11E.1
N$512: IC58.3(A:Q0) IC62.2(A12) RA11C.1
N$513: IC58.4(A:Q1) IC62.26(A13) RA11B.1
N$514: IC58.5(A:Q2) IC62.27(A14) RA11A.1
N$515: IC58.6(A:Q3) IC59.12(D:I0) IC59.13(D:I1) IC62.20(!CE)
N$516: IC63.2(Q0) RA10A.1
N$517: IC63.5(Q1) RA10B.1
N$518: IC63.7(Q2) RA10C.1
N$519: IC63.10(Q3) RA10D.1
N$520: IC63.12(Q4) RA10E.1
N$521: C50.2 IC58.7(A:RES) IC60.4(A:R) IC60.10(B:R) IC61.11(RES) R189.1
N$522: IC63.15(Q5) RA10F.1
TRIG_CRASH: C50.1 ; also sheet 1
Unconnected: IC62.11(D0) IC62.12(D1) VR24.M2 VR25.M2

### Notes on the sheet
- Crash

## Sheet 11 of 15: RIDE
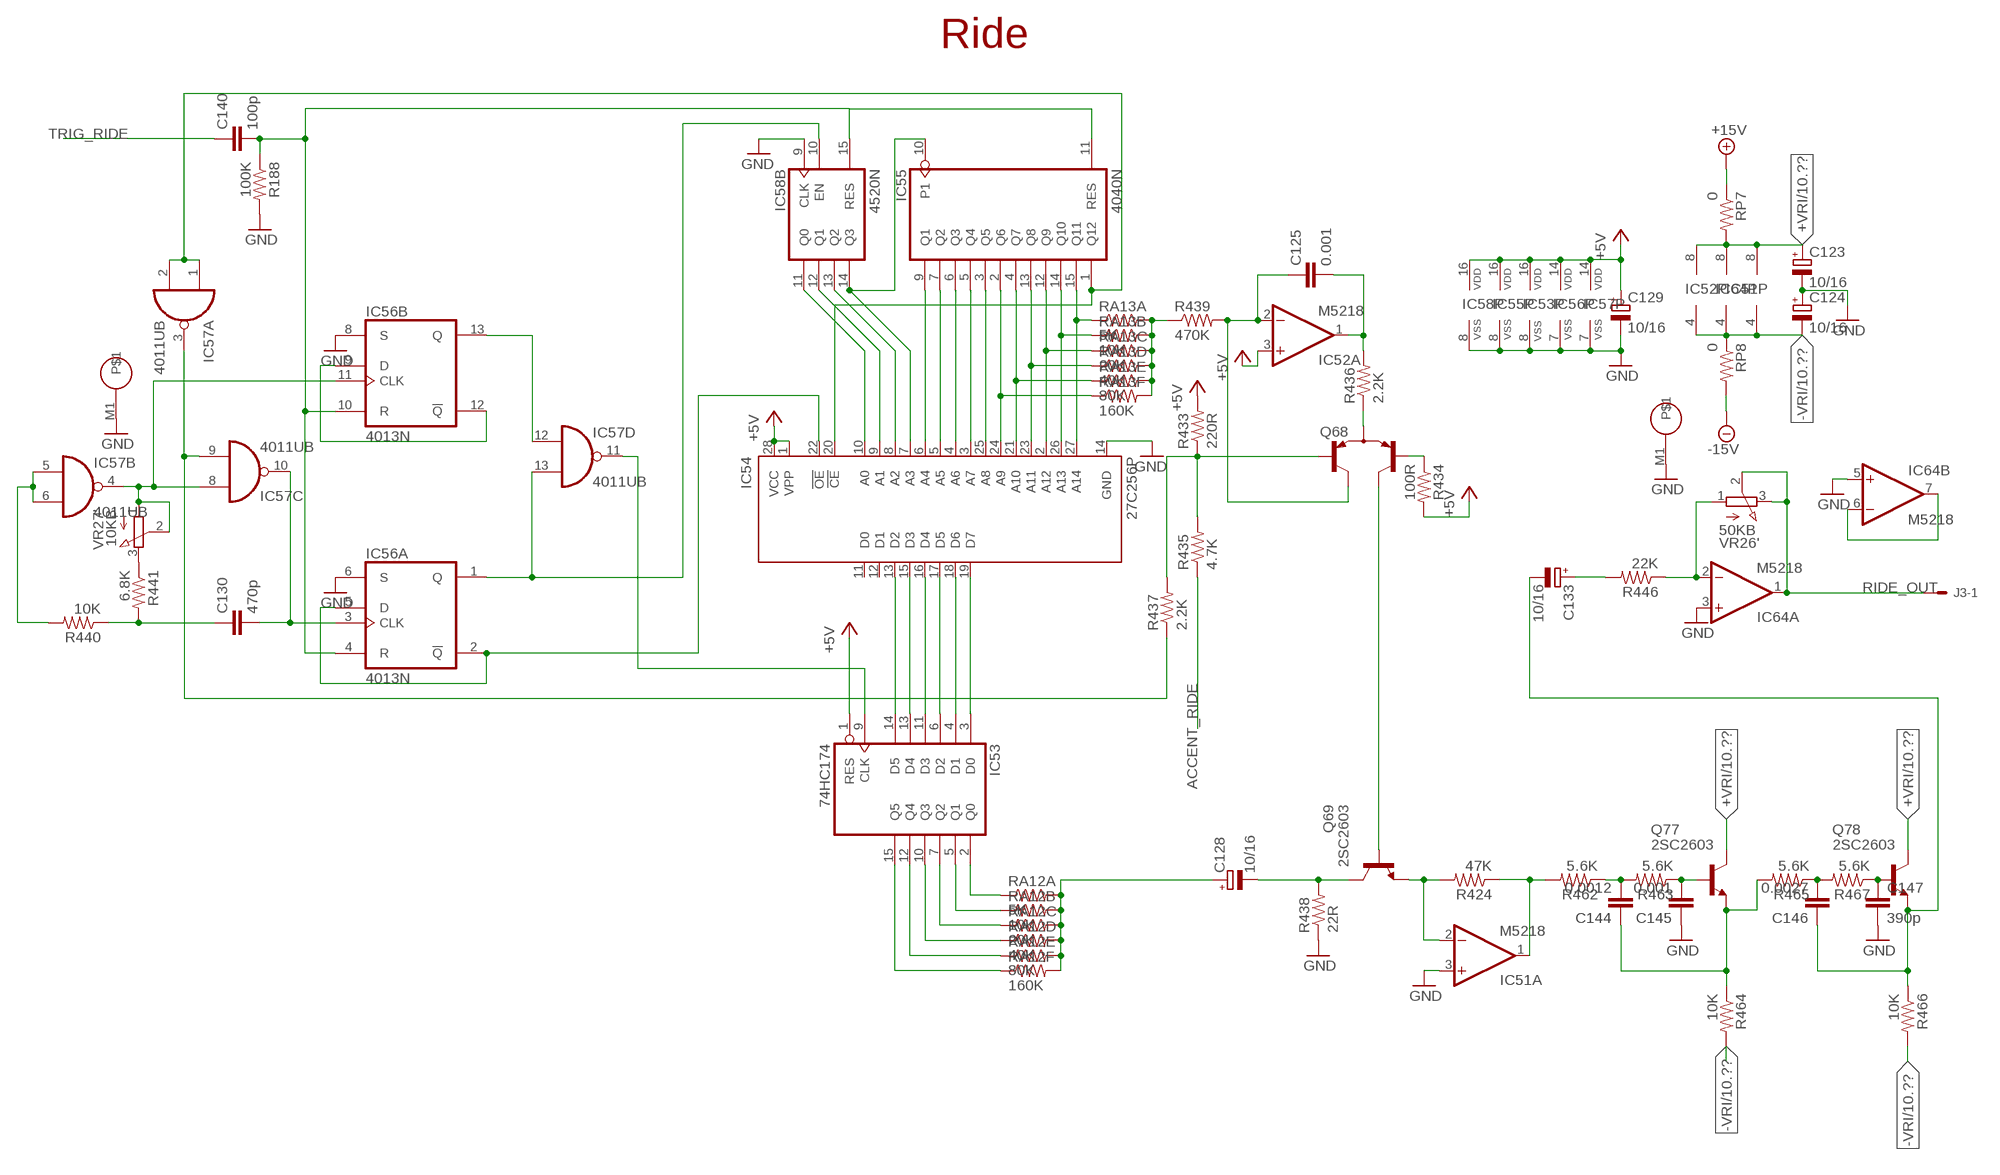
[diagram p10: schematic, sheet 11]

### Parts
C123  10/16  CPOL-EUE2-5  [E2-5]
C124  10/16  CPOL-EUE2-5  [E2-5]
C125  0.001  C-EU050-025X075  [C050-025X075]
C128  10/16  CPOL-EUE2-5  [E2-5]
C129  10/16  CPOL-EUE2-5  [E2-5]
C130  470p  C-EU025-050  [C025_RE]
C133  10/16  CPOL-EUE2-5  [E2-5]
C140  100p  C-EU050-025X075  [C050-025X075]
C144  0.0012  C-EU050-025X075  [C050-025X075]
C145  0.001  C-EU050-025X075  [C050-025X075]
C146  0.0027  C-EU050-025X075  [C050-025X075]
C147  390p  C-EU025-050  [C025_RE]
IC53  74HC174  4174P  [DIL16]
IC54  27C256P  [DIL28-6]
IC55  4040N  [DIL16]
IC56  4013N  [DIL14]
IC57  4011UB  4011N  [DIL14]
IC64  M5218  [SIL8]
Q68  2SA798  [SIP-5]
Q69  2SC2603  [TO92-ECB]
Q77  2SC2603  [TO92-ECB]
Q78  2SC2603  [TO92-ECB]
R188  100K  R-US_0207/7  [0207/7]
R424  47K  R-US_0207/7  [0207/7]
R433  220R  R-US_0207/7  [0207/7]
R434  100R  R-US_0207/7  [0207/7]
R435  4.7K  R-US_0207/7  [0207/7]
R436  2.2K  R-US_0207/7  [0207/7]
R437  2.2K  R-US_0207/7  [0207/7]
R438  22R  R-US_0207/7  [0207/7]
R439  470K  R-US_0207/7  [0207/7]
R440  10K  R-US_0207/7  [0207/7]
R441  6.8K  R-US_0207/7  [0207/7]
R446  22K  R-US_0207/7  [0207/7]
R462  5.6K  R-US_0207/7  [0207/7]
R463  5.6K  R-US_0207/7  [0207/7]
R464  10K  R-US_0207/7  [0207/7]
R465  5.6K  R-US_0207/7  [0207/7]
R466  10K  R-US_0207/7  [0207/7]
R467  5.6K  R-US_0207/7  [0207/7]
RA12A  5K  R-US_0207/7  [0207/7]
RA12B  10K  R-US_0207/7  [0207/7]
RA12C  20K  R-US_0207/7  [0207/7]
RA12D  40K  R-US_0207/7  [0207/7]
RA12E  80K  R-US_0207/7  [0207/7]
RA12F  160K  R-US_0207/7  [0207/7]
RA13A  5K  R-US_0207/7  [0207/7]
RA13B  10K  R-US_0207/7  [0207/7]
RA13C  20K  R-US_0207/7  [0207/7]
RA13D  40K  R-US_0207/7  [0207/7]
RA13E  80K  R-US_0207/7  [0207/7]
RA13F  160K  R-US_0207/7  [0207/7]
RP7  0  R-US_0207/7  [0207/7]
RP8  0  R-US_0207/7  [0207/7]
VR26  50KB  EVUF3A  [EVUF]
VR27  10KB  EVUF3A  [EVUF]

### Nets
+5V: C129.+ IC52.3(A:+IN) IC53.1(RES) IC53.16(VDD) IC54.1(VPP) IC54.28(VCC) IC55.16(VDD) IC56.14(P:VDD) IC57.14(P:VDD) IC58.16(P:VDD) R433.2 R434.2 ; also sheet 1,9,10,14,15
+15V: RP7.1 ; also sheet 1,2,3,4,6,7,8,9,12,13
+VRI [power]: C123.+ IC51.8(P:V+) IC52.8(P:V+) IC64.8(P:V+) Q77.C Q78.C RP7.2 ; also sheet 10
-15V: RP8.2 ; also sheet 1,2,3,4,6,7,8,9,12,13
-VRI [power]: C124.- IC51.4(P:V-) IC52.4(P:V-) IC64.4(P:V-) R464.2 R466.2 RP8.1 ; also sheet 10
ACCENT_RIDE: R435.1 ; also sheet 1
GND: C123.- C124.+ C129.- C145.1 C147.- IC51.3(A:+IN) IC53.8(VSS) IC54.14(GND) IC55.8(VSS) IC56.6(A:S) IC56.7(P:VSS) IC56.8(B:S) IC57.7(P:VSS) IC58.8(P:VSS) IC58.9(B:CLK) IC64.3(A:+IN) IC64.5(B:+IN) R188.2 R438.1 VR26.M1 VR27.M1 ; also sheet 1,2,3,4,5,6,7,8,9,10,12,13,14,15
HT_OUT1: IC56.11(B:CLK) IC57.4(B:O) IC57.8(C:I0) VR27.1(':A) VR27.2(':S)
N$240: Q68.3(E) R436.1
N$406: IC56.1(A:Q) IC57.13(D:I1) IC58.10(B:EN)
N$407: IC53.3(D0) IC54.19(D7)
N$408: IC53.4(D1) IC54.18(D6)
N$409: IC53.6(D2) IC54.17(D5)
N$410: IC53.11(D3) IC54.16(D4)
N$411: IC53.13(D4) IC54.15(D3)
N$412: IC53.14(D5) IC54.13(D2)
N$413: IC54.24(A9) IC55.2(Q6) RA13F.1
N$414: IC54.25(A8) IC55.3(Q5)
N$415: IC54.21(A10) IC55.4(Q7) RA13E.1
N$416: IC54.3(A7) IC55.5(Q4)
N$417: IC54.4(A6) IC55.6(Q3)
N$418: IC54.5(A5) IC55.7(Q2)
N$419: IC54.6(A4) IC55.9(Q1)
N$420: IC54.2(A12) IC55.12(Q9) RA13C.1
N$421: IC54.23(A11) IC55.13(Q8) RA13D.1
N$422: IC54.26(A13) IC55.14(Q10) RA13B.1
N$423: IC54.27(A14) IC55.15(Q11) RA13A.1
N$425: IC54.10(A0) IC58.11(B:Q0)
N$426: IC54.9(A1) IC58.12(B:Q1)
N$428: IC57.5(B:I0) IC57.6(B:I1) R440.2
N$429: IC54.8(A2) IC58.13(B:Q2)
N$430: C130.+ R440.1 R441.2
N$431: IC57.3(A:O) IC57.9(C:I1) R437.1
N$432: C130.- IC56.3(A:CLK) IC57.10(C:O)
N$433: IC54.20(!CE) IC55.1(Q12) IC57.1(A:I0) IC57.2(A:I1)
N$434: IC53.2(Q0) RA12A.1
N$436: C146.2 R465.1 R467.2
N$437: IC56.9(B:D) IC56.12(B:!Q)
N$438: IC54.22(!OE) IC56.2(A:!Q) IC56.5(A:D)
N$439: IC56.13(B:Q) IC57.12(D:I0)
N$440: IC53.5(Q1) RA12B.1
N$441: IC53.7(Q2) RA12C.1
N$442: IC53.9(CLK) IC57.11(D:O)
N$443: IC53.10(Q3) RA12D.1
N$444: IC53.12(Q4) RA12E.1
N$445: IC53.15(Q5) RA12F.1
N$446: C128.+ RA12A.2 RA12B.2 RA12C.2 RA12D.2 RA12E.2 RA12F.2
N$447: R439.1 RA13A.2 RA13B.2 RA13C.2 RA13D.2 RA13E.2 RA13F.2
N$448: C125.1 IC52.2(A:-IN) Q68.2(C1) R439.2
N$449: C125.2 IC52.1(A:OUT) R436.2
N$451: Q68.5(B2) R434.1
N$452: Q68.4(C2) Q69.B
N$453: C128.- Q69.C R438.2
N$454: Q68.1(B1) R433.1 R435.2 R437.2
N$455: C144.2 R462.1 R463.2
N$456: C145.2 Q77.B R463.1
N$457: C147.+ Q78.B R467.1
N$458: IC51.2(A:-IN) Q69.E R424.2
N$459: IC51.1(A:OUT) R424.1 R462.2
N$460: C144.1 Q77.E R464.1 R465.2
N$461: C133.+ R446.2
N$462: C133.- C146.1 Q78.E R466.1
N$463: IC64.2(A:-IN) R446.1 VR26.1(':A)
N$464: IC54.7(A3) IC55.10(P1) IC58.14(B:Q3)
N$465: C140.2 IC55.11(RES) IC56.4(A:R) IC56.10(B:R) IC58.15(B:RES) R188.1
N$719: IC64.6(B:-IN) IC64.7(B:OUT)
N$724: R441.1 VR27.3(':E)
RIDE_OUT: IC64.1(A:OUT) J3.1 VR26.2(':S) VR26.3(':E)
TRIG_RIDE: C140.1 ; also sheet 1
Unconnected: IC54.11(D0) IC54.12(D1) VR26.M2 VR27.M2

### Notes on the sheet
- Ride

## Sheet 12 of 15: NOISE
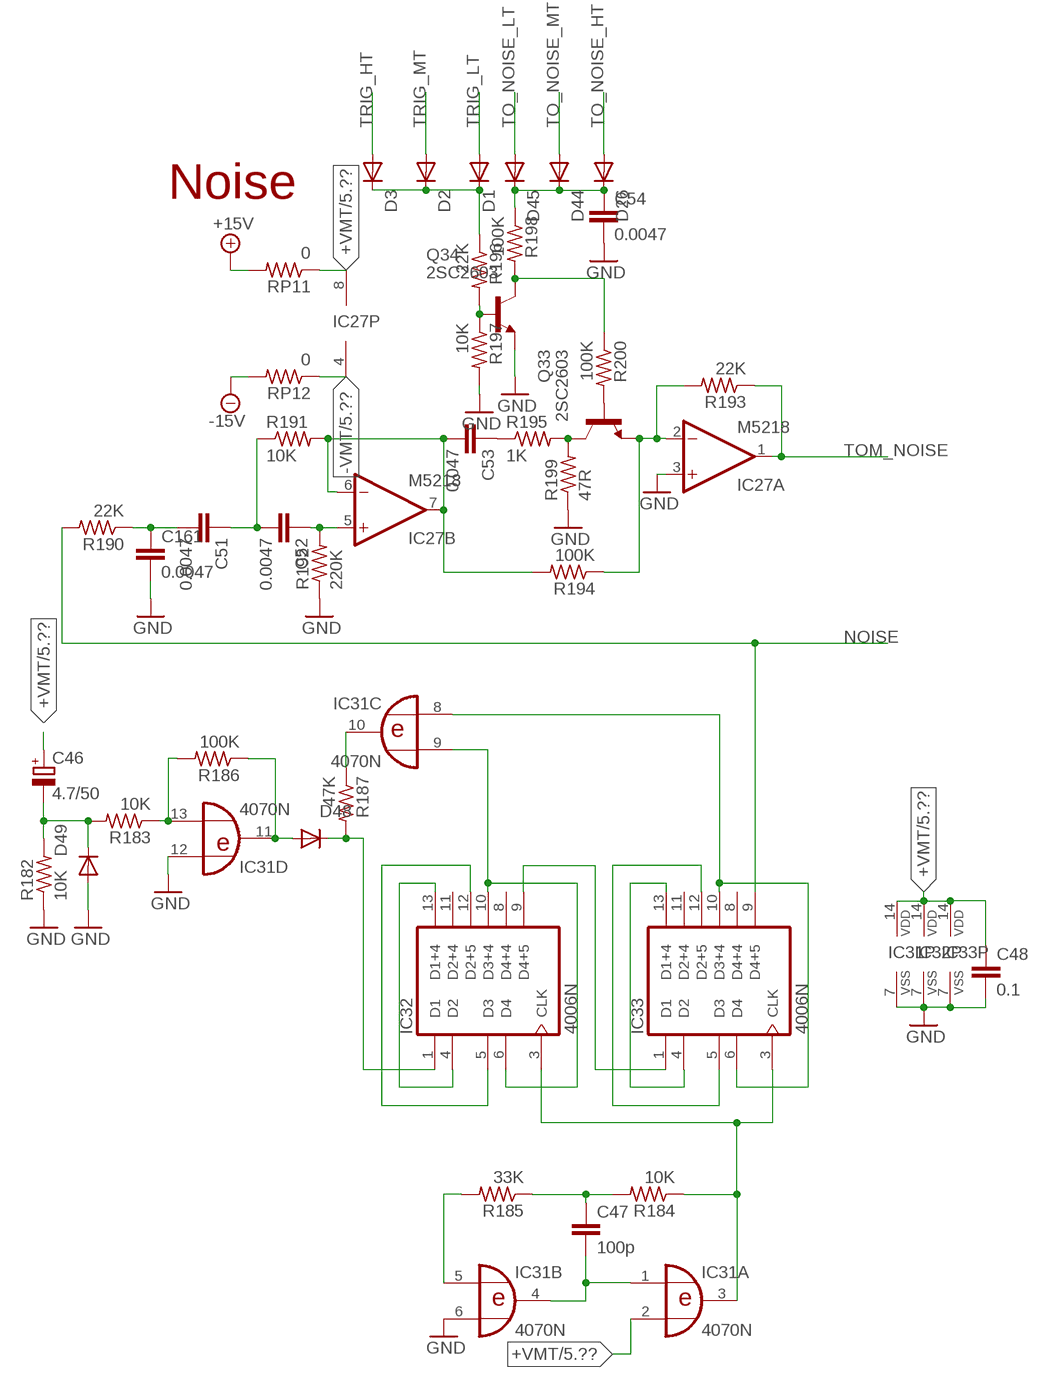
[diagram p11: schematic, sheet 12]

### Parts
C46  4.7/50  CPOL-EUE2-5  [E2-5]
C47  100p  C-EU050-025X075  [C050-025X075]
C48  0.1  C-EU050-024X044  [C050-024X044]
C51  0.0047  C-EU050-025X075  [C050-025X075]
C52  0.0047  C-EU050-025X075  [C050-025X075]
C53  0.047  C-EU050-025X075  [C050-025X075]
C54  0.0047  C-EU050-025X075  [C050-025X075]
C161  0.0047  C-EU050-025X075  [C050-025X075]
D1  1N4148"  [DO35-7C]
D2  1N4148"  [DO35-7C]
D3  1N4148"  [DO35-7C]
D26  1N4148"  [DO35-7C]
D44  1N4148"  [DO35-7C]
D45  1N4148"  [DO35-7C]
D48  1N4148"  [DO35-7C]
D49  1N4148"  [DO35-7C]
IC27  M5218  [SIL8]
IC31  4070N  [DIL14]
IC32  4006N  [DIL14]
IC33  4006N  [DIL14]
Q33  2SC2603  [TO92-ECB]
Q34  2SC2603  [TO92-ECB]
R182  10K  R-US_0207/7  [0207/7]
R183  10K  R-US_0207/7  [0207/7]
R184  10K  R-US_0207/7  [0207/7]
R185  33K  R-US_0207/7  [0207/7]
R186  100K  R-US_0207/7  [0207/7]
R187  47K  R-US_0207/7  [0207/7]
R190  22K  R-US_0207/7  [0207/7]
R191  10K  R-US_0207/7  [0207/7]
R192  220K  R-US_0207/7  [0207/7]
R193  22K  R-US_0207/7  [0207/7]
R194  100K  R-US_0207/7  [0207/7]
R195  1K  R-US_0207/7  [0207/7]
R196  22K  R-US_0207/7  [0207/7]
R197  10K  R-US_0207/7  [0207/7]
R198  100K  R-US_0207/7  [0207/7]
R199  47R  R-US_0207/7  [0207/7]
R200  100K  R-US_0207/7  [0207/7]
RP11  0  R-US_0207/7  [0207/7]
RP12  0  R-US_0207/7  [0207/7]

### Nets
+15V: RP11.2 ; also sheet 1,2,3,4,6,7,8,9,11,13
+VMT [power]: C46.+ C48.1 IC27.8(P:V+) IC31.2(A:I1) IC31.14(P:VDD) IC32.14(VDD) IC33.14(VDD) RP11.1 ; also sheet 5
-15V: RP12.2 ; also sheet 1,2,3,4,6,7,8,9,11,13
-VMT [power]: IC27.4(P:V-) RP12.1 ; also sheet 5
GND: C48.2 C54.2 C161.2 D49.A IC27.3(A:+IN) IC31.6(B:I1) IC31.7(P:VSS) IC31.12(D:I0) IC32.7(VSS) IC33.7(VSS) Q34.E R182.1 R192.1 R197.2 R199.1 ; also sheet 1,2,3,4,5,6,7,8,9,10,11,13,14,15
N$534: C51.2 C161.1 R190.1
N$580: C51.1 C52.2 R191.1
N$635: C52.1 IC27.5(B:+IN) R192.2
N$636: C53.2 IC27.6(B:-IN) IC27.7(B:OUT) R191.2 R194.2
N$637: C53.1 R195.1
N$638: Q33.C R195.2 R199.2
N$712: IC27.2(A:-IN) Q33.E R193.2 R194.1
N$713: Q33.B R200.2
N$714: Q34.B R196.2 R197.1
N$716: Q34.C R198.2 R200.1
N$717: IC32.4(D2) IC32.13(D1+4)
N$726: D1.C D2.C D3.C R196.1
N$727: C54.1 D26.C D44.C D45.C R198.1
N$728: C46.- D49.C R182.2 R183.2
N$729: IC31.13(D:I1) R183.1 R186.2
N$730: D48.A IC31.11(D:O) R186.1
N$731: IC31.10(C:O) R187.1
N$732: IC33.4(D2) IC33.13(D1+4)
N$733: IC31.9(C:I1) IC32.6(D4) IC32.10(D3+4)
N$734: IC32.5(D3) IC32.12(D2+5)
N$735: D48.C IC32.1(D1) R187.2
N$736: IC31.8(C:I0) IC33.6(D4) IC33.10(D3+4)
N$737: IC33.5(D3) IC33.12(D2+5)
N$738: IC32.9(D4+5) IC33.1(D1)
N$739: IC31.5(B:I0) R185.2
N$741: C47.1 R184.2 R185.1
N$742: C47.2 IC31.1(A:I0) IC31.4(B:O)
N$743: IC31.3(A:O) IC32.3(CLK) IC33.3(CLK) R184.1
NOISE [NOISE]: IC33.9(D4+5) R190.2 ; also sheet 2,3,8
TO_NOISE_HT: D26.A ; also sheet 6
TO_NOISE_LT: D45.A ; also sheet 4
TO_NOISE_MT: D44.A ; also sheet 5
TOM_NOISE: IC27.1(A:OUT) R193.1 ; also sheet 4,5,6
TRIG_HT: D3.A ; also sheet 1,6
TRIG_LT: D1.A ; also sheet 1,4
TRIG_MT: D2.A ; also sheet 1,5
Unconnected: IC32.8(D4+4) IC32.11(D2+4) IC33.8(D4+4) IC33.11(D2+4)

### Notes on the sheet
- Noise

## Sheet 13 of 15: Master
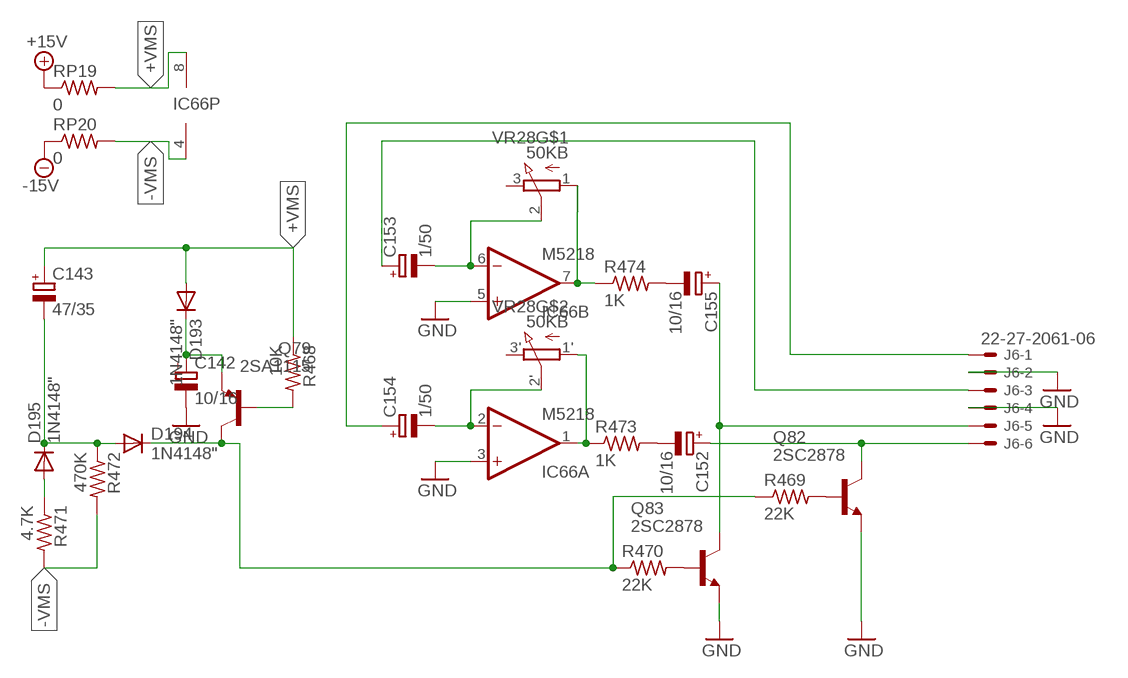
[diagram p12: schematic, sheet 13]

### Parts
C142  10/16  CPOL-EUE2-5  [E2-5]
C143  47/35  CPOL-EUE2.5-6  [E2,5-6]
C152  10/16  CPOL-EUE2-5  [E2-5]
C153  1/50  CPOL-EUE2-5  [E2-5]
C154  1/50  CPOL-EUE2-5  [E2-5]
C155  10/16  CPOL-EUE2-5  [E2-5]
D193  1N4148"  [DO35-7C]
D194  1N4148"  [DO35-7C]
D195  1N4148"  [DO35-7C]
IC66  M5218  [SIL8]
J6  22-27-2061-06  [6410-06]
Q79  2SA1115  [TO92-ECB-PNP]
Q82  2SC2878  [TO92-ECB]
Q83  2SC2878  [TO92-ECB]
R468  10K  R-US_0207/7  [0207/7]
R469  22K  R-US_0207/7  [0207/7]
R470  22K  R-US_0207/7  [0207/7]
R471  4.7K  R-US_0207/7  [0207/7]
R472  470K  R-US_0207/7  [0207/7]
R473  1K  R-US_0207/7  [0207/7]
R474  1K  R-US_0207/7  [0207/7]
RP19  0  R-US_0207/7  [0207/7]
RP20  0  R-US_0207/7  [0207/7]
VR28  50KB  POT_DUAL  [PTV112-4]

### Nets
+15V: RP19.1 ; also sheet 1,2,3,4,6,7,8,9,11,12
+VMS: C143.+ D193.A IC66.8(P:V+) R468.1 RP19.2
-15V: RP20.1 ; also sheet 1,2,3,4,6,7,8,9,11,12
-VMS: IC66.4(P:V-) R471.2 R472.2 RP20.2
GND: C142.- IC66.3(A:+IN) IC66.5(B:+IN) J6.2 J6.4 Q82.E Q83.E ; also sheet 1,2,3,4,5,6,7,8,9,10,11,12,14,15
N$269: D195.A R471.1
N$274: C143.- D194.A D195.C R472.1
N$720: IC66.7(B:OUT) R474.1 VR28.1
N$721: IC66.1(A:OUT) R473.1 VR28.1'
N$770: D194.C Q79.C R469.1 R470.1
N$772: C142.+ D193.C Q79.E
N$773: Q79.B R468.2
N$774: C154.- IC66.2(A:-IN) VR28.2'
N$775: C153.- IC66.6(B:-IN) VR28.2
N$778: C155.- R474.2
N$779: C152.- R473.2
N$780: Q82.B R469.2
N$781: Q83.B R470.2
N$782: C153.+ J6.3
N$783: C155.+ J6.5 Q83.C
N$784: C152.+ J6.6 Q82.C
N$785: C154.+ J6.1
Unconnected: VR28.3 VR28.3'

## Sheet 14 of 15: PSU
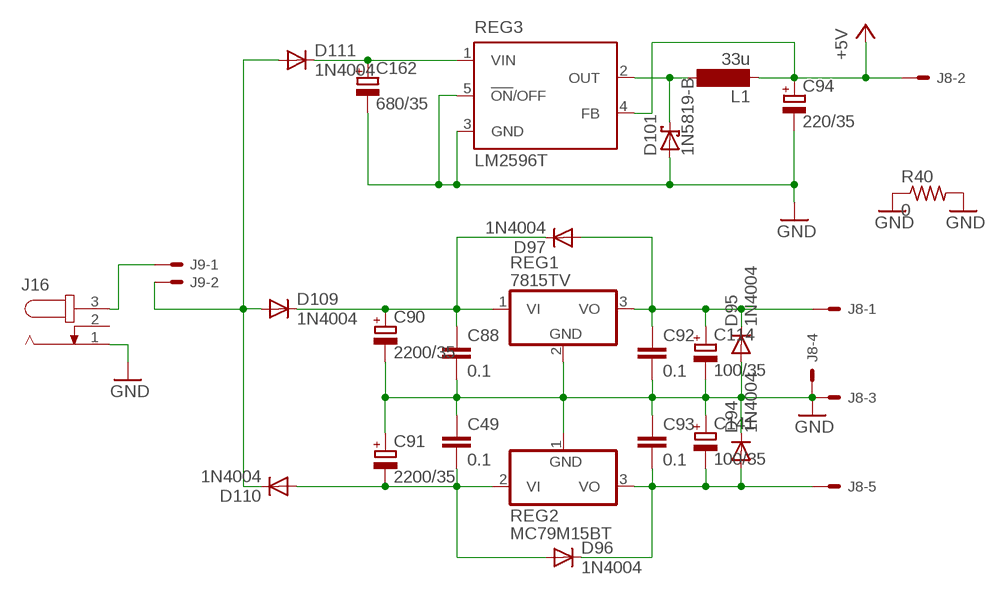
[diagram p13: schematic, sheet 14]

### Parts
C49  0.1  C-EU050-024X044  [C050-024X044]
C88  0.1  C-EU050-024X044  [C050-024X044]
C90  2200/35  CPOL-EUE7.5-16  [E7,5-16]
C91  2200/35  CPOL-EUE7.5-16  [E7,5-16]
C92  0.1  C-EU050-024X044  [C050-024X044]
C93  0.1  C-EU050-024X044  [C050-024X044]
C94  220/35  CPOL-EUE3.5-8  [E3,5-8]
C114  100/35  CPOL-EUE3.5-8  [E3,5-8]
C141  100/35  CPOL-EUE3.5-8  [E3,5-8]
C162  680/35  CPOL-EUE5-13  [E5-13]
D94  1N4004  [DO41-7]
D95  1N4004  [DO41-7]
D96  1N4004  [DO41-7]
D97  1N4004  [DO41-7]
D101  1N5819-B  [DO41-7.6]
D109  1N4004  [DO41-7]
D110  1N4004  [DO41-7]
D111  1N4004  [DO41-7]
J8  KK-156-5  [KK-156-5]
J9  KK-156-2  [KK-156-2]
J16  JACK-PLUG0  [JACK_PSU_2.1MM]
L1  33u  BS11  [BS11]
R40  0  R-US_0207/7  [0207/7]
REG1  7815TV  [TO220V]
REG2  MC79M15BT  [TO220V]
REG3  LM2596T  [T05D]

### Nets
+5V: C94.+ J8.2 L1.1 REG3.4(FB) ; also sheet 1,9,10,11,15
GND: C49.1 C88.2 C90.- C91.+ C92.2 C93.1 C94.- C114.- C141.+ C162.- D94.C D95.A D101.A J8.3 J8.4 J16.1 R40.1 R40.2 REG1.2(GND) REG2.1(GND) REG3.3(GND) REG3.5(!ON!/OFF) ; also sheet 1,2,3,4,5,6,7,8,9,10,11,12,13,15
N$270 [power]: C49.2 C91.- D96.A D110.A REG2.2(VI)
N$271 [power]: C88.1 C90.+ D97.C D109.C REG1.1(VI)
N$788 [power]: C92.1 C114.+ D95.C D97.A J8.1 REG1.3(VO)
N$789 [power]: D109.A D110.C D111.A J9.2
N$790 [power]: C93.2 C141.- D94.A D96.C J8.5 REG2.3(VO)
N$791 [power]: C162.+ D111.C REG3.1(VIN)
N$792 [power]: D101.C L1.2 REG3.2(OUT)
N$830: J9.1 J16.3
Unconnected: J16.2

## Sheet 15 of 15: IO
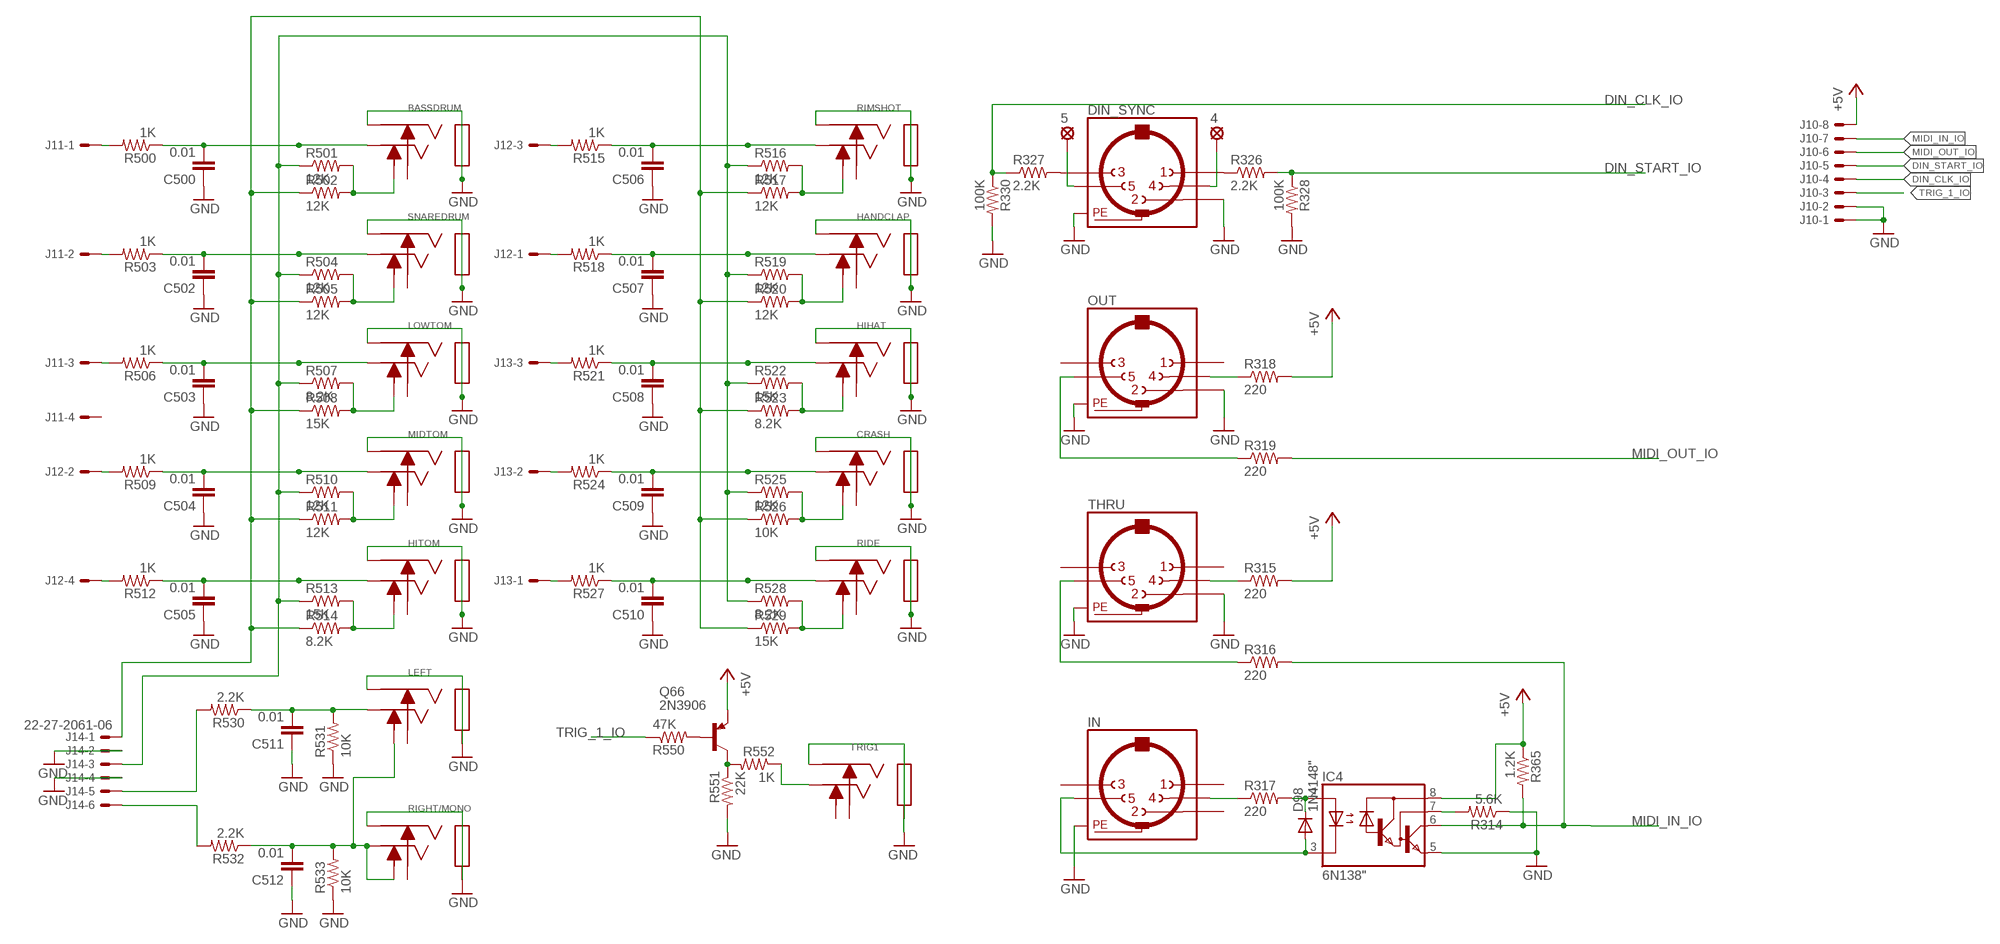
[diagram p14: schematic, sheet 15]

### Parts
4  LSP10  [LSP10]
5  LSP10  [LSP10]
BASSDRUM  JACK_TRSNRJ6HF  [JACK_TRS]
C500  0.01  C-EU050-025X075  [C050-025X075]
C502  0.01  C-EU050-025X075  [C050-025X075]
C503  0.01  C-EU050-025X075  [C050-025X075]
C504  0.01  C-EU050-025X075  [C050-025X075]
C505  0.01  C-EU050-025X075  [C050-025X075]
C506  0.01  C-EU050-025X075  [C050-025X075]
C507  0.01  C-EU050-025X075  [C050-025X075]
C508  0.01  C-EU050-025X075  [C050-025X075]
C509  0.01  C-EU050-025X075  [C050-025X075]
C510  0.01  C-EU050-025X075  [C050-025X075]
C511  0.01  C-EU050-025X075  [C050-025X075]
C512  0.01  C-EU050-025X075  [C050-025X075]
CRASH  JACK_TRSNRJ6HF  [JACK_TRS]
D98  1N4148"  [DO35-7C]
DIN_SYNC  MAB5SH  [MAB5SH]
HANDCLAP  JACK_TRSNRJ6HF  [JACK_TRS]
HIHAT  JACK_TRSNRJ6HF  [JACK_TRS]
HITOM  JACK_TRSNRJ6HF  [JACK_TRS]
IC4  6N138"  [DIL08]
IN  MAB5SH  [MAB5SH]
J10  22-27-2081-08  [6410-08]
J11  22-27-2041-04  [6410-04]
J12  22-27-2041-04  [6410-04]
J13  22-27-2041-04  [6410-04]
J14  22-27-2061-06  [6410-06]
LEFT  JACK_TRSNRJ6HF  [JACK_TRS]
LOWTOM  JACK_TRSNRJ6HF  [JACK_TRS]
MIDTOM  JACK_TRSNRJ6HF  [JACK_TRS]
OUT  MAB5SH  [MAB5SH]
Q66  2N3906  [TO92-EBC-SMALL]
R314  5.6K  R-US_0207/7  [0207/7]
R315  220  R-US_0207/7  [0207/7]
R316  220  R-US_0207/7  [0207/7]
R317  220  R-US_0207/7  [0207/7]
R318  220  R-US_0207/7  [0207/7]
R319  220  R-US_0207/7  [0207/7]
R326  2.2K  R-US_0207/7  [0207/7]
R327  2.2K  R-US_0207/7  [0207/7]
R328  100K  R-US_0207/7  [0207/7]
R330  100K  R-US_0207/7  [0207/7]
R365  1.2K  R-US_0207/7  [0207/7]
R500  1K  R-US_0207/7  [0207/7]
R501  12K  R-US_0207/7  [0207/7]
R502  12K  R-US_0207/7  [0207/7]
R503  1K  R-US_0207/7  [0207/7]
R504  12K  R-US_0207/7  [0207/7]
R505  12K  R-US_0207/7  [0207/7]
R506  1K  R-US_0207/7  [0207/7]
R507  8.2K  R-US_0207/7  [0207/7]
R508  15K  R-US_0207/7  [0207/7]
R509  1K  R-US_0207/7  [0207/7]
R510  12K  R-US_0207/7  [0207/7]
R511  12K  R-US_0207/7  [0207/7]
R512  1K  R-US_0207/7  [0207/7]
R513  15K  R-US_0207/7  [0207/7]
R514  8.2K  R-US_0207/7  [0207/7]
R515  1K  R-US_0207/7  [0207/7]
R516  12K  R-US_0207/7  [0207/7]
R517  12K  R-US_0207/7  [0207/7]
R518  1K  R-US_0207/7  [0207/7]
R519  12K  R-US_0207/7  [0207/7]
R520  12K  R-US_0207/7  [0207/7]
R521  1K  R-US_0207/7  [0207/7]
R522  15K  R-US_0207/7  [0207/7]
R523  8.2K  R-US_0207/7  [0207/7]
R524  1K  R-US_0207/7  [0207/7]
R525  12K  R-US_0207/7  [0207/7]
R526  10K  R-US_0207/7  [0207/7]
R527  1K  R-US_0207/7  [0207/7]
R528  8.2K  R-US_0207/7  [0207/7]
R529  15K  R-US_0207/7  [0207/7]
R530  2.2K  R-US_0207/7  [0207/7]
R531  10K  R-US_0207/7  [0207/7]
R532  2.2K  R-US_0207/7  [0207/7]
R533  10K  R-US_0207/7  [0207/7]
R550  47K  R-US_0207/7  [0207/7]
R551  22K  R-US_0207/7  [0207/7]
R552  1K  R-US_0207/7  [0207/7]
RIDE  JACK_TRSNRJ6HF  [JACK_TRS]
RIGHT/MONO  JACK_TRSNRJ6HF  [JACK_TRS]
RIMSHOT  JACK_TRSNRJ6HF  [JACK_TRS]
SNAREDRUM  JACK_TRSNRJ6HF  [JACK_TRS]
THRU  MAB5SH  [MAB5SH]
TRIG1  JACK_TRSNRJ6HF  [JACK_TRS]

### Nets
+5V: IC4.8(VCC) J10.8 Q66.E R315.2 R318.2 R365.1 ; also sheet 1,9,10,11,14
DIN_CLK_IO [special]: J10.4 R327.1 R330.1
DIN_START_IO [special]: J10.5 R326.2 R328.1
GND: BASSDRUM.R BASSDRUM.S C500.1 C502.1 C503.1 C504.1 C505.1 C506.1 C507.1 C508.1 C509.1 C510.1 C511.1 C512.1 CRASH.R CRASH.S DIN_SYNC.2 DIN_SYNC.PE DIN_SYNC.PE@(PE) HANDCLAP.R HANDCLAP.S HIHAT.R HIHAT.S HITOM.R HITOM.S IC4.5(GND) IN.PE IN.PE@(PE) J10.1 J10.2 J14.2 J14.4 LEFT.R LEFT.S LOWTOM.R LOWTOM.S MIDTOM.R MIDTOM.S OUT.2 OUT.PE OUT.PE@(PE) R314.1 R328.2 R330.2 R531.1 R533.1 R551.2 RIDE.R RIDE.S RIGHT/MONO.R RIGHT/MONO.S RIMSHOT.R RIMSHOT.S SNAREDRUM.R SNAREDRUM.S THRU.2 THRU.PE THRU.PE@(PE) TRIG1.R TRIG1.S ; also sheet 1,2,3,4,5,6,7,8,9,10,11,12,13,14
MIDI_IN_IO [special]: IC4.6(VO) J10.7 R316.2 R365.2
MIDI_OUT_IO [special]: J10.6 R319.2
N$276: R552.1 TRIG1.T
N$427: 5.MP DIN_SYNC.5
N$776: 4.MP DIN_SYNC.4
N$793: BASSDRUM.TN R501.2 R502.2
N$794: BASSDRUM.T C500.2 R500.1
N$795: Q66.B R550.2
N$796: J11.1 R500.2
N$797: C512.2 LEFT.TN R532.1 R533.2 RIGHT/MONO.T RIGHT/MONO.TN
N$798: R504.2 R505.2 SNAREDRUM.TN
N$799: C502.2 R503.1 SNAREDRUM.T
N$800: J11.2 R503.2
N$801: C511.2 LEFT.T R530.1 R531.2
N$802: LOWTOM.TN R507.2 R508.2
N$803: C503.2 LOWTOM.T R506.1
N$804: J11.3 R506.2
N$805: J12.1 R518.2
N$806: MIDTOM.TN R510.2 R511.2
N$807: C504.2 MIDTOM.T R509.1
N$808: J12.2 R509.2
N$809: J12.3 R515.2
N$810: HITOM.TN R513.2 R514.2
N$811: C505.2 HITOM.T R512.1
N$812: J14.1 R502.1 R505.1 R508.1 R511.1 R514.1 R517.1 R520.1 R523.1 R526.1 R529.1
N$813: J12.4 R512.2
N$814: R516.2 R517.2 RIMSHOT.TN
N$815: C506.2 R515.1 RIMSHOT.T
N$816: J13.1 R527.2
N$817: J13.2 R524.2
N$818: HANDCLAP.TN R519.2 R520.2
N$819: IN.4 R317.1
N$820: D98.C IC4.2(A) R317.2
N$821: D98.A IC4.3(C) IN.5
N$822: R315.1 THRU.4
N$823: R316.1 THRU.5
N$824: IC4.7(VB) R314.2
N$825: OUT.4 R318.1
N$826: OUT.5 R319.1
N$827: DIN_SYNC.1 R326.1
N$828: DIN_SYNC.3 R327.2
N$829: C507.2 HANDCLAP.T R518.1
N$832: Q66.C R551.1 R552.2
N$833: J13.3 R521.2
N$836: HIHAT.TN R522.2 R523.2
N$837: C508.2 HIHAT.T R521.1
N$838: J14.5 R530.2
N$839: J14.6 R532.2
N$840: CRASH.TN R525.2 R526.2
N$841: C509.2 CRASH.T R524.1
N$844: R528.2 R529.2 RIDE.TN
N$845: C510.2 R527.1 RIDE.T
N$847: J14.3 R501.1 R504.1 R507.1 R510.1 R513.1 R516.1 R519.1 R522.1 R525.1 R528.1
TRIG_1_IO [special]: J10.3 R550.1
Unconnected: BASSDRUM.RN CRASH.RN HANDCLAP.RN HIHAT.RN HITOM.RN IN.1 IN.2 IN.3 J11.4 J13.4 LEFT.RN LOWTOM.RN MIDTOM.RN OUT.1 OUT.3 RIDE.RN RIGHT/MONO.RN RIMSHOT.RN SNAREDRUM.RN THRU.1 THRU.3 TRIG1.RN TRIG1.TN

## Library data of the parts
4 5 = solpad:LSP10: SOLDER PAD drill 1.0 mm, distributor Buerklin, 12H555
BASSDRUM CRASH HANDCLAP HIHAT HITOM LEFT LOWTOM MIDTOM RIDE RIGHT/MONO RIMSHOT SNAREDRUM TRIG1 = tr909:JACK_TRS: Neutrik
C1-C7 C12-C14 C16-C20 C24 C25 C30-C34 C38 C39 C42 C43 C47 C48 C50-C54 C56 C58 C59 C61-C64 C66 C68-C71 C73 C75-C77 C79-C85 C95-C97 C101-C103 C106 C111-C113 C115-C122 C125 C126 C130 C131 C134 C136-C140 C144-C151 C156 C159-C161 C500 C502-C512 = rcl:C-EU: CAPACITOR, European symbol
C8-C11 C15 C21-C23 C26-C29 C35-C37 C40 C41 C44-C46 C55 C57 C60 C65 C67 C72 C74 C78 C86 C87 C98-C100 C104 C105 C107-C110 C123 C124 C127-C129 C132 C133 C135 C142 C143 C152-C155 C157 C158 C515 C520 = rcl:CPOL-EU: POLARIZED CAPACITOR, European symbol
C49 C88 C92 C93 C169 C513 C514 C521-C524 C600-C612 C614 = TR808clone:C-EU: CAPACITOR, European symbol
C90 C91 C94 C114 C141 C162 = TR808clone:CPOL-EU: POLARIZED CAPACITOR, European symbol
D1-D15 D17-D33 D35-D56 D58-D70 D73-D92 D98 D193-D199 = diode:1N4148: DIODE high speed (Philips)
D16 D34 D57 D72 = diode:ZENER-DIODE: Z-Diode
D94-D97 D109-D111 = diode:1N4004: DIODE general purpose rectifier, 1 A
D101 = diode:1N581*: 1.0A SCHOTTKY BARRIER RECTIFIER Source: http://www.diodes.com/datasheets/ds23001.pdf
DIN_SYNC IN OUT THRU = E-licktonic:MAB5SH: Female CONNECTOR 5 pins 90 deg. with shield, horizontal (DIN 41524); OC_FARNELL: 809883; OC_NEWARK: unknown
DIS1 = display-lcd:TUXGR_16X2_R2: Tuxgraphics LCD display 16x2 characters reflective, with background light Source: tuxgr_12x2_r2.pdf; OC_FARNELL: unknown; OC_NEWARK: unknown
G1-G9 = wirepad:WIREPAD: Wire PAD connect wire on PCB
GND TP1 = testpad:TP: Test pad
IC1 = linear:TL072: OP AMP
IC4 = optocoupler:6N138: MOTOROLA OPTO COUPLER; MF: VISHAY/TELEFUNKEN; MPN: 6N138; OC_FARNELL: 9860150; OC_NEWARK: 35K5294
IC11-IC15 IC17-IC21 IC23-IC28 IC34 IC35 IC37-IC40 IC42 IC43 IC45-IC52 IC64-IC67 = mitsubishi-semiconductor:M5218: DUAL LOW-NOISE OPERATIONAL AMPLIFIER (DUAL POWER SUPPLY TYPE) Source: Mitsubishi M5218AL/P/FP
IC16 IC22 IC36 IC44 = 40xx:4069: Hex INVERTER
IC29 = TR808clone:AN6912: Quad Comparator
IC30 = TR808clone:BA6110
IC31 = 40xx:4070: Quad 2-input XOR
IC32 IC33 = 40xx:4006: 18-bit static SHIFT REGISTER
IC53 IC63 IC68 = 41xx:4174: 41xx DEVICE
IC54 IC62 IC69 = microchip:27*256: CMOS EPROM 256 K (32 K x 8), low voltage; MF: Arrow Electronics; MPN: M27C256B15F1; OC_FARNELL: 1125431; OC_NEWARK: 93K7335
IC55 IC61 IC71 = 40xx:4040: 12-stage binary/ripple COUNTER
IC56 IC60 IC73 = 40xx:4013: Dual D FLIP FLOP, set/reset
IC57 IC59 IC72 = 40xx:4011: Quad 2-input NAND
IC58 IC70 = 45xx:4520: Dual binary up COUNTER
IC100 IC102 IC104 IC105 IC108 = 74xx-eu:74*165: 8-bit parallel load SHIFT REGISTER
IC101 IC106 IC107 IC112 IC113 IC116 IC117 = 74xx-eu:74*595: 8-bit SHIFT REGISTER, output latch
IC111 IC114 = 40xx:4051: 8-channel ANALOG MULTIPLEXER
IC115 = atmel:AT24C*: 2-wire serial EEPROM; MPN: AT24C1024BW-SH-B; OC_FARNELL: 1362646; OC_NEWARK: 03P2044
IC118 = microchip:MCP4822: Dual 12 Bits DAC with internal Vref and SPI interface
IC119 = atmel:ATMEGA644-*PU: 8-bit Microcontroller with 64K Bytes In-System Programmable Flash Auto generated by make-symbol-device-package-bsdl.ulp Rev. 34 Source: http://www.atmel.com/dyn/resources/prod_documents/doc2593.pdf; MPN: ATMEGA644-20PU; OC_FARNELL: 1288340; OC_NEWARK: 23M5060
ICSP J15 = con-lstb:MA03-2: PIN HEADER; OC_FARNELL: unknown; OC_NEWARK: unknown
J1 J3 J4 J11-J13 = con-molex:22-?-04: CONNECTOR wire to board 2.54 mm (.1 inch) pitch header; OC_FARNELL: unknown; OC_NEWARK: unknown
J2 J10 = con-molex:22-?-08: CONNECTOR wire to board 2.54 mm (.1 inch) pitch header; OC_FARNELL: unknown; OC_NEWARK: unknown
J5 J8 = con-molex:KK-156-5: KK 156 HEADER Source: http://www.molex.com/pdm_docs/sd/026604100_sd.pdf; OC_FARNELL: unknown; OC_NEWARK: unknown
J6 J14 = con-molex:22-?-06: CONNECTOR wire to board 2.54 mm (.1 inch) pitch header; OC_FARNELL: unknown; OC_NEWARK: unknown
J7 = con-lstb:MA05-1: PIN HEADER
J9 = con-molex:KK-156-2: KK 156 HEADER Source: http://www.molex.com/pdm_docs/sd/026604100_sd.pdf; OC_FARNELL: unknown; OC_NEWARK: unknown
J16 = con-jack:JACK-PLUG: DC POWER JACK Power Jack, DC, Right Angle, Through Hole, Rated 5A at 16VDC, PC Terminals Distributor: Farnell (www.Farnell.de) Drawing: 84N1161.pdf / 84N1162.pdf Manufacturer: SPC Technology (www.spctechnology.com) Type: SPC4077 / SPC 4078; OC_FARNELL: unknown; OC_NEWARK: unknown
L1 = inductor-neosid:BS: INDUCTOR nominal inductance, magnetically screened; OC_FARNELL: unknown; OC_NEWARK: unknown
LED1-LED4 = led:LED: LED OSRAM: - CHIPLED LG R971, LG N971, LY N971, LG Q971, LY Q971, LO R971, LY R971 LH N974, LH R974 LS Q976, LO Q976, LY Q976 LO Q996 - Hyper CHIPLED LW Q18S LB Q993, LB Q99A, LB R99A - SideLED LS A670, LO A670, LY A670, LG A670, LP A670 LB A673, LV A673, LT A673, LW A673 LH A674 LY A675 LS A676, LA A676, LO A676, LY A676, LW A676 LS A679, LY A679, LG A679 - Hyper Micro SIDELED® LS Y876, LA Y876, LO Y876, LY Y876 LT Y87S - SmartLED LW L88C, LW L88S LB L89C, LB L89S, LG L890 LS L89K, LO L89K, LY L89K LS L896, LA L896, LO L896, LY L896 - TOPLED LS T670, LO T670, LY T670, LG T670, LP T670 LSG T670, LSP T670, LSY T670, LOP T670, LYG T670 LG T671, LOG T671, LSG T671 LB T673, LV T673, LT T673, LW T673 LH T674 LS T676, LA T676, LO T676, LY T676, LB T676, LH T676, LSB T676, LW T676 LB T67C, LV T67C, LT T67C, LS T67K, LO T67K, LY T67K, LW E67C LS E67B, LA E67B, LO E67B, LY E67B, LB E67C, LV E67C, LT E67C LW T67C LS T679, LY T679, LG T679 LS T770, LO T770, LY T770, LG T770, LP T770 LB T773, LV T773, LT T773, LW T773 LH T774 LS E675, LA E675, LY E675, LS T675 LS T776, LA T776, LO T776, LY T776, LB T776 LHGB T686 LT T68C, LB T68C - Hyper Mini TOPLED® LB M676 - Mini TOPLED Santana® LG M470 LS M47K, LO M47K, LY M47K Source: http://www.osram.convergy.de LUXEON: - LUMILED® LXK2-PW12-R00, LXK2-PW12-S00, LXK2-PW14-U00, LXK2-PW14-V00 LXK2-PM12-R00, LXK2-PM12-S00, LXK2-PM14-U00 LXK2-PE12-Q00, LXK2-PE12-R00, LXK2-PE12-S00, LXK2-PE14-T00, LXK2-PE14-U00 LXK2-PB12-K00, LXK2-PB12-L00, LXK2-PB12-M00, LXK2-PB14-N00, LXK2-PB14-P00, LXK2-PB14-Q00 LXK2-PR12-L00, LXK2-PR12-M00, LXK2-PR14-Q00, LXK2-PR14-R00 LXK2-PD12-Q00, LXK2-PD12-R00, LXK2-PD12-S00 LXK2-PH12-R00, LXK2-PH12-S00 LXK2-PL12-P00, LXK2-PL12-Q00, LXK2-PL12-R00 Source: www.luxeon.com KINGBRIGHT: KA-3528ASYC Source: www.kingbright.com
Q1 Q3 Q6 Q9 Q11-Q14 Q16 Q18-Q23 Q25-Q28 Q30-Q35 Q37 Q39 Q43-Q46 Q49-Q59 Q61 Q63 Q65 Q69 Q71 Q72 Q74-Q78 Q80 Q81 Q86 = tr909:2SC2603
Q2 Q4 Q5 Q7 Q8 Q10 Q15 Q17 Q24 Q29 Q36 Q40-Q42 Q60 Q62 Q64 Q73 Q79 = tr909:2SA1115
Q38 Q68 Q70 Q84 = tr909:2SA798: PNP DIFFERENTAL AMP SIP-5 Source: 2SA798.pdf
Q47 Q48 = tr909:2SD1469
Q66 = transistor-pnp:2N3906: PNP Transistor
Q82 Q83 = tr909:2SC2878
R1-R12 R12A R13-R173 R175-R230 R233-R305 R314-R319 R326-R391 R394-R404 R406-R408 R411 R414-R496 R500-R533 R550-R552 R688-R693 R695-R697 R699 R700 RA9A RA9B RA9C RA9D RA9E RA9F RA10A RA10B RA10C RA10D RA10E RA10F RA11A RA11B RA11C RA11D RA11E RA11F RA12A RA12B RA12C RA12D RA12E RA12F RA13A RA13B RA13C RA13D RA13E RA13F RP1-RP20 = rcl:R-US_: RESISTOR, American symbol
R600-R647 R655-R665 R667-R687 R694 = resistor:R-US_: RESISTOR, American symbol
REG1 = linear:78*: Positive VOLTAGE REGULATOR Source: http://cache.national.com/ds/LM/LM78L05.pdf http://www.fairchildsemi.com/ds/LM/LM7805.pdf
REG2 = linear:MC79M: 500 mA Negative Voltage Regulators Source: Data sheet <http://www.onsemi.com/pub_link/Collateral/MC79M00-D.PDF>
REG3 = national-semiconductor:LM2596: SIMPLE SWITCHER® Power Converter 150 kHz 3A Step-Down Voltage Regulator Source: http://www.national.com/ds/LM/LM2596.pdf; MPN: LM2596T-ADJ/LF02; OC_FARNELL: 9494162; OC_NEWARK: 65K5910
S1-S19 = tr909:MX1A_CHERRY_SW_LED
S20-S36 = tr909:ZTSN_SW_LED
TM1 TM2 = pot:TRIM_US-: POTENTIOMETER
TM3 = TR808clone:TRIM_EU-: POTENTIOMETER
VR2-VR27 = pot:EVU: 9 mm Square Rotary Potentiometers Source: Panasonic
VR28 = tr909:POT_DUAL
VR29 = tr909:PEC16_ENCODER: BOURNS Rotary encoder with switch serie PEC16
X1 = special:XTAL/S: CRYSTAL

## Net classes
0 default: width 0.381 mm, drill 0.254 mm, clearance 0.254 mm
1 GND: width 0.762 mm, drill 0.254 mm, clearance 0.381 mm
2 power: width 0.61 mm, drill 0.254 mm, clearance 0.381 mm
3 special: width 0.254 mm, drill 0.254 mm, clearance 0.254 mm
4 NOISE: width 0.381 mm, drill 0.254 mm, clearance 0.508 mm
5 isolate: width 0.381 mm, drill 0.254 mm, clearance 1.016 mm